# EasyEDA Pro project F103_遥控板_2025-11-19.epro

# Schematic F103遥控原理图
Board Name: 遥控板; Create Date: 2025-01-30; Page Name: P1; Project Name: F405空心杯飞控; Schematic Name: F103遥控原理图; Update Date: 2025-02-16; Company: 嘉立创EDA; Page Size: A4; Version: V1.0
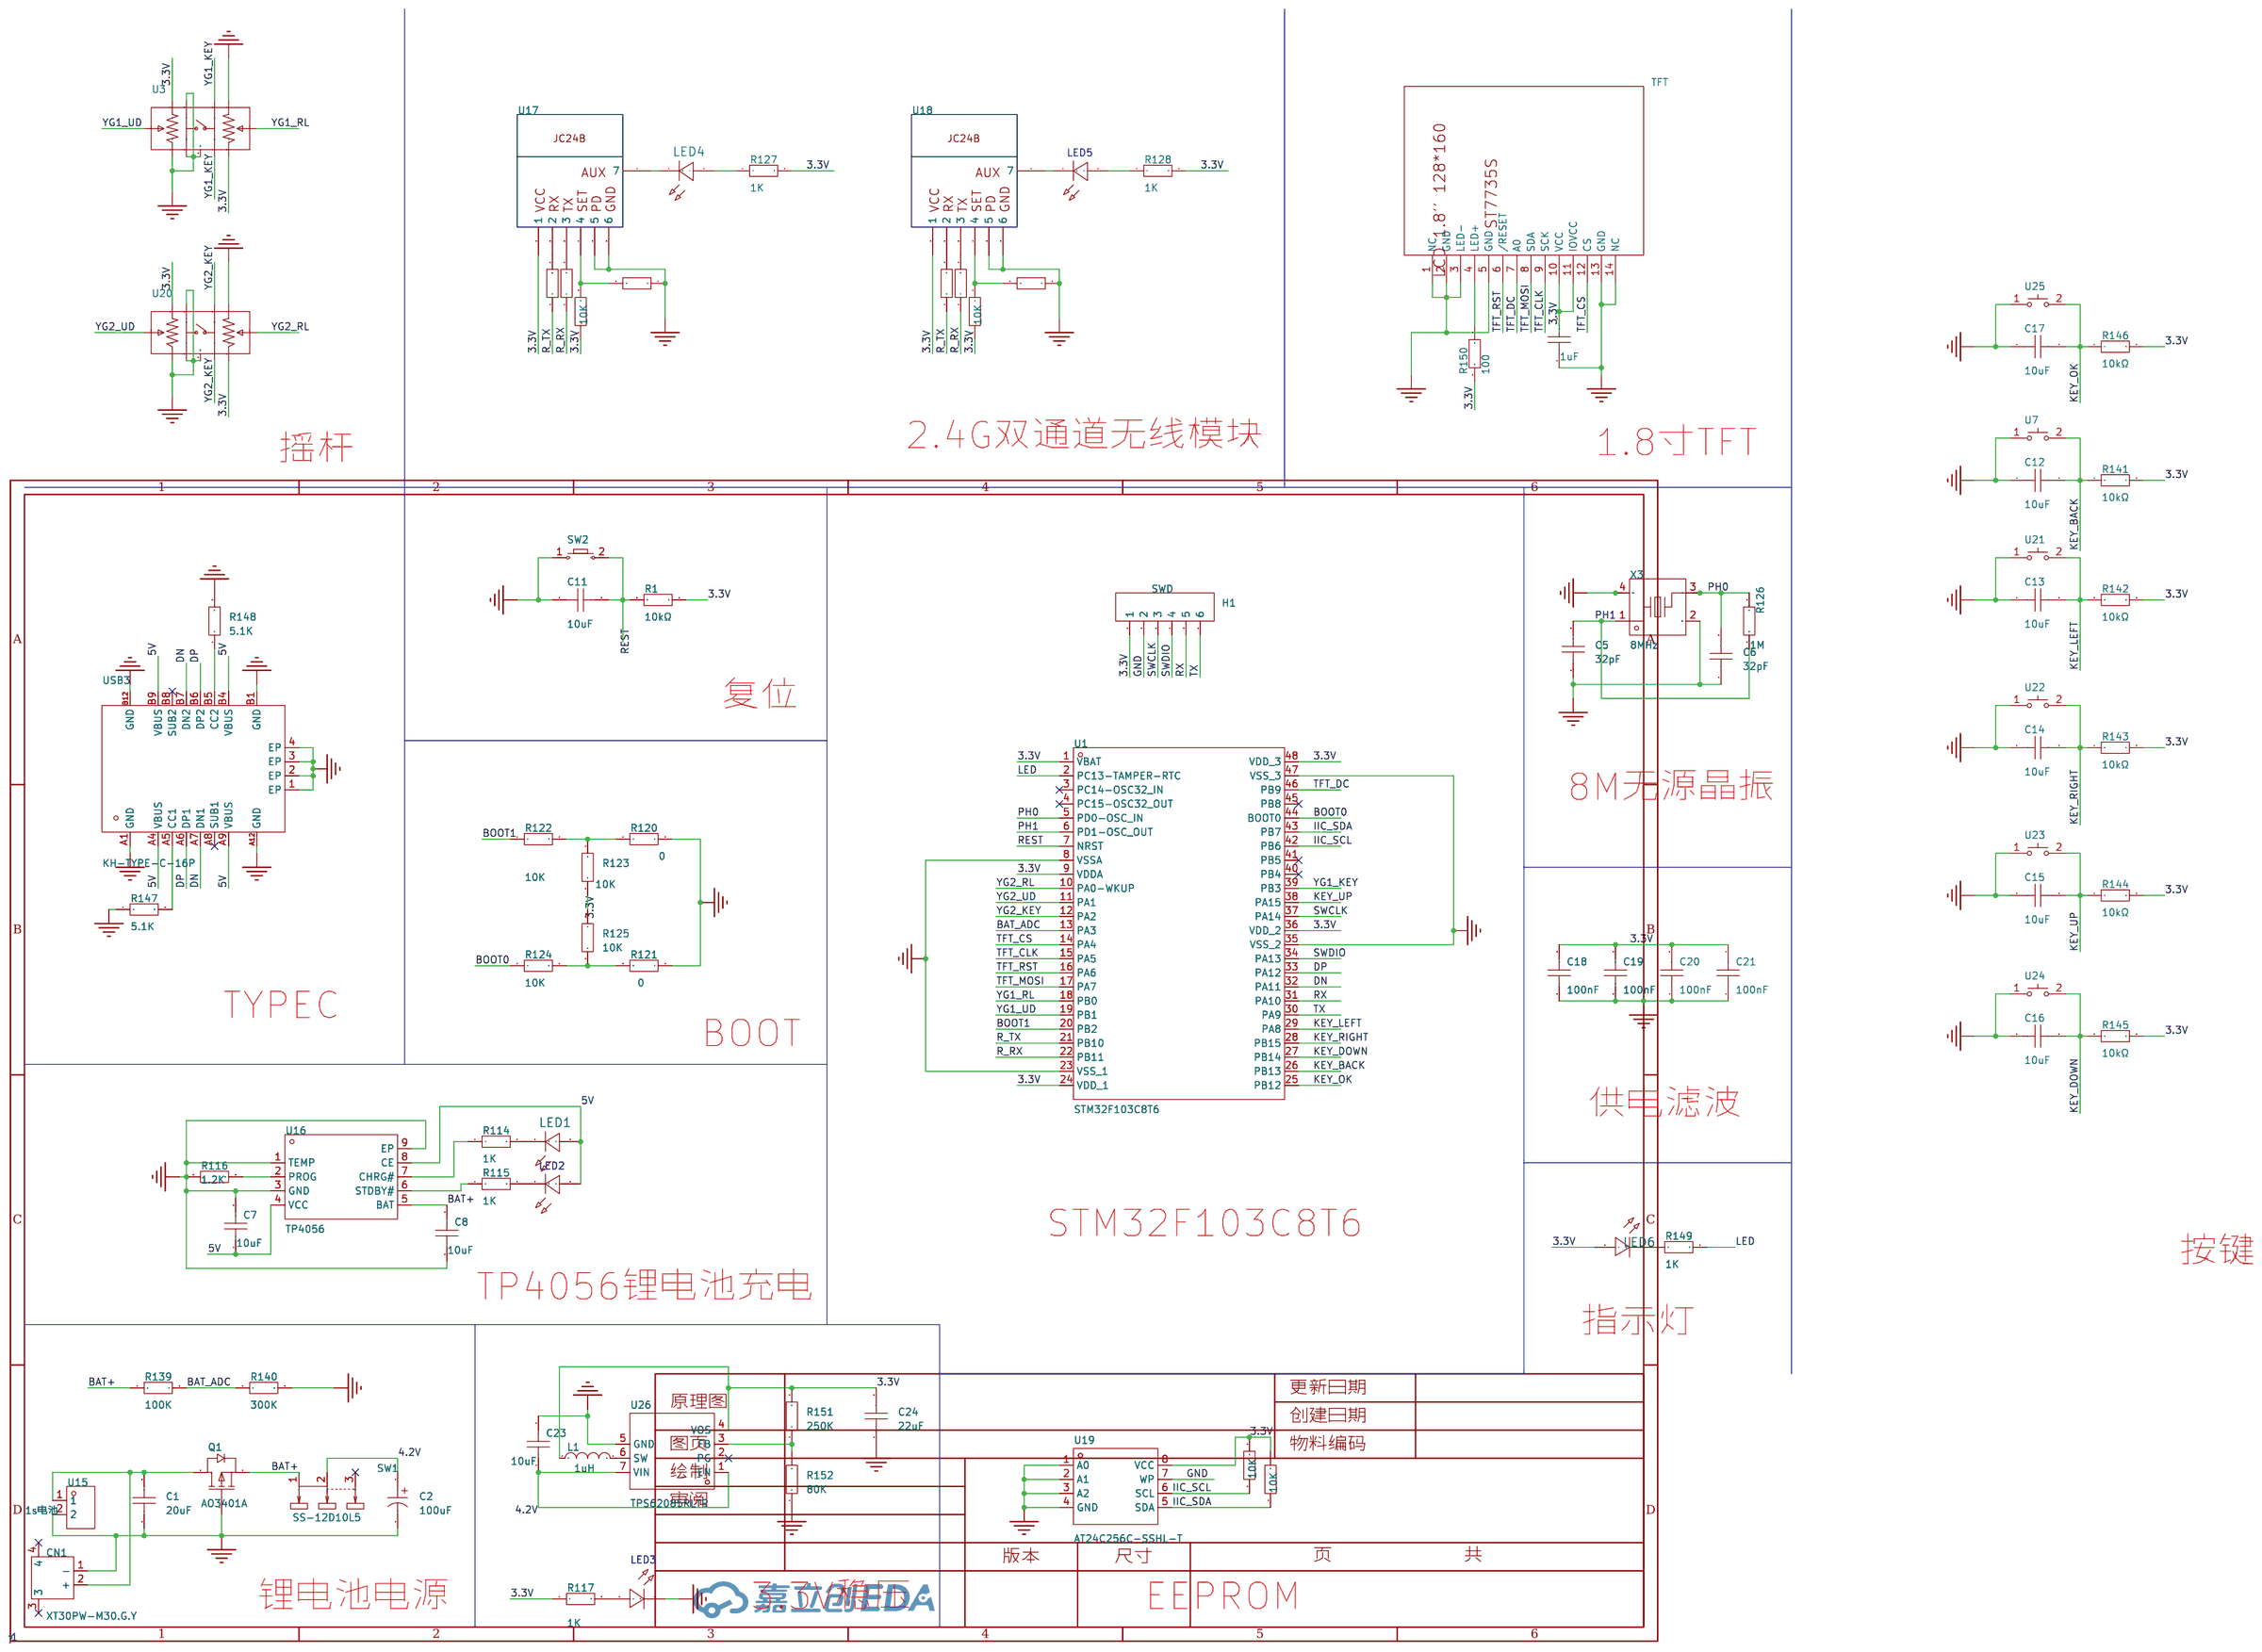
[diagram p0: schematic sheet]

## Parts
C1  20uF  [C0805]
C2  100uF  [CAP-SMD_BD6.3-L6.6-W6.6-LS7.4-FD]
C5  32pF  [C0603]
C6  32pF  [C0603]
C7  10uF  [C0805]
C8  10uF  [C0805]
C11  10uF  [C0805]
C12  10uF  [C0805]
C13  10uF  [C0805]
C14  10uF  [C0805]
C15  10uF  [C0805]
C16  10uF  [C0805]
C17  10uF  [C0805]
C18  100nF  [C0603]
C19  100nF  [C0603]
C20  100nF  [C0603]
C21  100nF  [C0603]
C22  1uF  [C0603]
C23  10uF  [C0805]
C24  22uF  [C0805]
CN1  XT30PW-M30.G.Y  [CONN-TH_XT30PW-M]
H1  SWD  [HDR-TH_6P-P2.54-V-M-1]
L1  1uH  [IND-SMD_L5.4-W5.2_FXL0530]
LCD2  TFT  [1.8寸TFT]
LED1  -  [LED_0805]
LED2  -  [LED_0805]
LED3  -  [LED_0805]
LED4  -  [LED_0805]
LED5  -  [LED_0805]
LED6  -  [LED_0805]
Q1  AO3401A  [SOT-23_L2.9-W1.3-P1.90-LS2.4-BR]
R1  10kΩ  [R0603]
R114  1K  [R0603]
R115  1K  [R0603]
R116  1.2K  [R0603]
R117  1K  [R0603]
R120  0  [R0402]
R121  0  [R0402]
R122  10K  [R0603]
R123  10K  [R0603]
R124  10K  [R0603]
R125  10K  [R0603]
R126  1M  [R0603]
R127  1K  [R0603]
R128  1K  [R0603]
R129  0  [R0402]
R130  0  [R0402]
R131  0  [R0402]
R132  10K  [R0603]
R133  0  [R0402]
R134  0  [R0402]
R135  0  [R0402]
R136  10K  [R0603]
R137  10K  [R0603]
R138  10K  [R0603]
R139  100K  [R0603]
R140  300K  [R0603]
R141  10kΩ  [R0603]
R142  10kΩ  [R0603]
R143  10kΩ  [R0603]
R144  10kΩ  [R0603]
R145  10kΩ  [R0603]
R146  10kΩ  [R0603]
R147  5.1K  [R0603]
R148  5.1K  [R0603]
R149  1K  [R0603]
R150  100  [R0603]
R151  250K  [R0603]
R152  80K  [R0603]
SW1  SS-12D10L5  [SW-TH_SS-12D10L5]
SW2  -  [Key_SMD_3x4x2]
U1  STM32F103C8T6  [LQFP-48_L7.0-W7.0-P0.50-LS9.0-BL]
U3  YHE-YG13-013 SH3B166A5  [JOYTICK-TH_YHE-YG13-013-SH3B166A5]
U7  TS-1199A26050  [SW-SMD_L6.0-W6.0-LS6.6]
U15  1s电池  [CONN-TH_2P-P2.50_BX-XH2.54-2PZZ]
U16  TP4056  [ESOP-8_L4.9-W3.9-P1.27-LS6.0-BL-EP]
U17  -  [JC24B]
U18  -  [JC24B]
U19  AT24C256C-SSHL-T  [SOIC-8_L4.9-W3.9-P1.27-LS6.0-BL]
U20  YHE-YG13-013 SH3B166A5  [JOYTICK-TH_YHE-YG13-013-SH3B166A5]
U21  TS-1199A26050  [SW-SMD_L6.0-W6.0-LS6.6]
U22  TS-1199A26050  [SW-SMD_L6.0-W6.0-LS6.6]
U23  TS-1199A26050  [SW-SMD_L6.0-W6.0-LS6.6]
U24  TS-1199A26050  [SW-SMD_L6.0-W6.0-LS6.6]
U25  TS-1199A26050  [SW-SMD_L6.0-W6.0-LS6.6]
U26  TPS62085RLTR  [VSON-7_L2.0-W2.0-P0.5-TL]
USB3  KH-TYPE-C-16P  [USB-C-SMD_KH-TYPE-C-16P]
X3  8MHz  [CRYSTAL-SMD_4P-L3.2-W2.5-BL]

## Library data of the parts
C1 C7 C8 C11-C17 C23 C24 = CAP_0805: Supplier Footprint: 0805
C2 = RVT100UF35V67RV0034: 容值:100uF;精度:±20%;额定电压:35V;纹波电流:87mA@120kHz;等效串联电阻:-;; LCSC Part Name: 100uF ±20% 35V; Supplier Part: C2836442; Manufacturer: KNSCHA(科尼盛); Supplier Footprint: SMD,D6.3xL7.7mm; JLCPCB Part Class: 扩展库; Datasheet: https://atta.szlcsc.com/upload/public/pdf/source/20210528/C2836442_7F6389BF36F63F32D6DF3A507E8E95D6.pdf; Supplier: LCSC; Tolerance: ±20%; Rated Voltage: 35V; Ripple Current: 87mA@120kHz; φD: 6.3mm; L: 7.7mm; Lifetime @ Temp: 2000hrs@105℃; Operating Temperature: -55℃~+105℃
C5 C6 C18-C22 = CAP_0603: Supplier Footprint: 0603
CN1 = XT30PW-M30.G.Y: 类别:-;类型1:-;; LCSC Part Name: AMASS(艾迈斯)航模插头 卧式弯脚 XT30PW-M公头; Supplier Part: C431092; Manufacturer: AMASS(艾迈斯); JLCPCB Part Class: 扩展库; Datasheet: https://atta.szlcsc.com/upload/public/pdf/source/20220222/6A9F22F7850E25B33E1BE430ADF8560B.pdf; Supplier: LCSC; Type: 航模插头; RatedVoltage: DC 500V; InterfaceType: 公头; RatedCurrent: 15A; RecommendedWireGauge: 16/18/20AWG; contact resistance: 1.2mΩ; specifications: 2pin
H1 = HDR-M_2.54_1x6P: Supplier Part: C37208; Supplier Footprint: 插件
L1 = FXL0530-1R0-M: 电感值:1uH;精度:±20%;额定电流:8.5A;饱和电流(Isat):11A;类型:一体成型电感;; LCSC Part Name: 1uH ±20% 11A; Supplier Part: C475517; Manufacturer: cjiang(长江微电); Supplier Footprint: SMD,5.2x5.4mm; JLCPCB Part Class: 扩展库; Datasheet: https://atta.szlcsc.com/upload/public/pdf/source/20240426/3189EA8206330E2108542F9E34E540E7.pdf; Supplier: LCSC; Tolerance: ±20%; Rated Current: 8.5A; Saturation Current (Isat): 11A; DC Resistance (DCR): 14mΩ; Type: 一体成型电感
LCD2 = 1.8寸TFT: 1.8寸，ST7735S
LED1 LED4 LED6 = LED_0805-R: Supplier Footprint: 0805
LED2 LED5 = LED_0805-B: Supplier Footprint: 0805
LED3 = LED_0805-G: Supplier Footprint: 0805
Q1 = AO3401A_C15127: 类型:1个P沟道;漏源电压(Vdss):30V;连续漏极电流(Id):4A;导通电阻(RDS(on)@Vgs,Id):44mΩ@10V,4.3A;功率(Pd):1.4W;阈值电压(Vgs(th)@Id):1.3V@250uA;; LCSC Part Name: 1个P沟道 耐压:30V 电流:4A; Supplier Part: C15127; Manufacturer: AOS; Supplier Footprint: SOT-23; JLCPCB Part Class: 基础库; Datasheet: https://atta.szlcsc.com/upload/public/pdf/source/20160507/1462613609053.pdf; Supplier: LCSC; Type: 1个P沟道; Drain Source Voltage (Vdss): 30V; Continuous Drain Current (Id): 4A; Drain Source On Resistance (RDS(on)@Vgs,Id): 44mΩ@10V,4.3A; Power Dissipation (Pd): 1.4W; Gate Threshold Voltage (Vgs(th)@Id): 1.3V@250uA; Total Gate Charge (Qg@Vgs): 12.2nC@4.5V; Input Capacitance (Ciss@Vds): 1.2nF@15V; Operating Temperature: -55℃~+150℃@(Tj)
R1 R141-R146 = 0805W8F4701T5E: 电阻类型:厚膜电阻;阻值:4.7kΩ;精度:±1%;功率:125mW;最大工作电压:150V;温度系数:±100ppm/℃;; LCSC Part Name: 4.7kΩ ±1% 125mW 厚膜电阻; Supplier Part: C17673; Manufacturer: UNI-ROYAL(厚声); Supplier Footprint: 0805; JLCPCB Part Class: 基础库; Datasheet: https://atta.szlcsc.com/upload/public/pdf/source/20200306/C422600_1E6D84923E4A46A82E41ADD87F860B5C.pdf; Supplier: LCSC; Type: 厚膜电阻; Tolerance: ±1%; Power(Watts): 125mW; Overload Voltage (Max): 150V; Temperature Coefficient: ±100ppm/℃; Operating Temperature Range: -55℃~+155℃
R114-R117 R122-R128 R132 R136-R140 R147-R152 = Res_0603: Supplier Footprint: 0603
R120 R121 R129-R131 R133-R135 = Res_0402: Supplier Footprint: 0402
SW1 = SS-12D10L5: 电路结构:单刀双掷;安装方式:直插;开关颜色:黑色;额定电流(DC):3A;额定电压(DC):125V;额定电流(AC):3A;额定电压(AC):125V;机械寿命:1万次;; LCSC Part Name: 柄长5mm 直插双档 滑动开关; Supplier Part: C319012; Manufacturer: XKB Connectivity(中国星坤); Supplier Footprint: 插件; JLCPCB Part Class: 扩展库; Datasheet: https://atta.szlcsc.com/upload/public/pdf/source/20211009/D6412F37AABE6F9459A6EE7FA4DAEADB.pdf; Supplier: LCSC; Circuit: 单刀双掷; Actuator Style: 矩形柱状; Pin Style: PC引脚; Switch Length: 13mm; Switch Width: 6.8mm; Switch Height: 6.4mm; Mounting Style: 直插; Actuator Color: 黑色; Current Rating (DC): 3A; Voltage Rating (DC): 125V; Current Rating (AC): 3A; Voltage Rating (AC): 125V; Mechanical Life: 1万次; Operating Temperature: -40℃~+85℃
SW2 = Key_SMD_3x4x2: Supplier Footprint: SMD
U1 = STM32F103C8T6: CPU内核:ARM-M3;CPU最大主频:72MHz;应用领域:-;; LCSC Part Name: 主流增强型ARM Cortex-M3 MCU，具有64 KB Flash、72 MHz CPU、电机控制、USB和CAN; Supplier Part: C8734; Manufacturer: ST(意法半导体); Supplier Footprint: LQFP-48(7x7); JLCPCB Part Class: 扩展库; Datasheet: https://atta.szlcsc.com/upload/public/pdf/source/20220812/8363ACEC51AD55ECEB84799464F7CB85.pdf; Supplier: LCSC; CPU Core: ARM-M3; CPU Maximum Speed: 72MHz; Program Storage Size: 64KB; Program Memory Type: FLASH; Number of I/O: 37; ADC (Bit): 12bit; Low Voltage Detection Threshold: 2V~3.6V
U3 U20 = YHE-YG13-013 SH3B166A5: 霍尔电位器摇杆、摇杆电位器、操纵杆电位器，适用于航模玩具遥控器电位器、3D摇杆PS4手柄游戏机、无人机摇杆电位器、VR摇杆电位器、工业控制器; Supplier Part: C42410941; Manufacturer: YTL(亚特联); Supplier Footprint: 插件; Datasheet: https://atta.szlcsc.com/upload/public/pdf/source/20241210/2E4471B96E441A4334C3B2A2D95CD7B2.pdf; Supplier: LCSC
U7 U21-U25 = TS-1199A26050: LCSC Part Name: 停产 6X6X5硅胶按键开关 260力度; Supplier Part: C7471808; Manufacturer: HanElectricity(瀚源); JLCPCB Part Class: 扩展库; Datasheet: https://atta.szlcsc.com/upload/public/pdf/source/20230804/DBC2CAE0DF05289A0977E10084746426.pdf; Supplier: LCSC
U15 = BX-XH2.54-2PZZ: 插针结构:1x2P;间距:2.54mm;安装方式:直插;参考系列:XH;总PIN数:2P;排数:1;每排PIN数:2;行距:-;额定电流:3A;触头材质:黄铜;触头镀层:锡;工作温度范围:-25℃~+85℃;; LCSC Part Name: 配套胶壳型号：BX-XH2.54-2PJK 配套端子型号：BX-XH2.54-DZ 配套杜邦线型号：BX-XH2.54-2PBXC; Supplier Part: C18077833; Manufacturer: Bossie(博锡); Supplier Footprint: 插件,P=2.54mm; JLCPCB Part Class: 扩展库; Datasheet: https://atta.szlcsc.com/upload/public/pdf/source/20231017/CB25E46A13930659CD6CDE2F2553A508.pdf; Supplier: LCSC; Pins Structure: 1x2P; Pitch: 2.54mm; Mounting Style: 直插; Reference Series: XH; Number of Pins: 2P; Number of Rows: 1; Number of PINs Per Row: 2; Current Rating (Max): 3A; Contact Material: 黄铜; Contact Plating: 锡; Operating Temperature Range: -25℃~+85℃
U16 = TP4056_C725790: Supplier Part: C725790; Manufacturer: UMW(友台半导体); Supplier Footprint: ESOP-8; JLCPCB Part Class: 扩展库; Datasheet: https://atta.szlcsc.com/upload/public/pdf/source/20231109/CF74897CE79A500F7FE27A45ADCCC631.pdf; Supplier: LCSC
U17 U18 = JC24B: J24B火蝠无线通信模块 距离200米  电压 / 3.3V  USART串口
U19 = AT24C256C-SSHL-T: 存储器容量:256Kb (32K x 8);存储器接口类型:I2C;工作电压:1.7V ~ 5.5V;; Supplier Part: C6482; Manufacturer: MICROCHIP(美国微芯); Supplier Footprint: SOIC-8_150mil; JLCPCB Part Class: Basic Part; Datasheet: https://atta.szlcsc.com/upload/public/pdf/source/20140724/1457707164965.pdf; Supplier: LCSC; Memory Format: EEPROM; Memory Size: 256Kb (32K x 8); Memory Interface: I2C; Voltage - Supply: 1.7V ~ 5.5V
U26 = TPS62085RLTR: 功能类型:降压型;输出类型:可调;工作电压:2.5V~6V;输出电压:-;输出电流:3A;; LCSC Part Name: 高效3A同步降压转换器; Supplier Part: C130072; Manufacturer: TI(德州仪器); Supplier Footprint: VSON-7(2x2); JLCPCB Part Class: 扩展库; Datasheet: https://www.ti.com/cn/lit/gpn/tps62085; Supplier: LCSC; Function: 降压型; Output Type: 可调; Input Voltage: 2.5V~6V; Output Current: 3A; Switching Frequency: 2.4MHz; Operating Temperature: -40℃~+125℃; Synchronous Rectification: 是; Number of Outputs: 1; Topology: 降压式; Quiescent Current (Iq): 17uA; Switch tube (built-in/external): 内置
USB3 = KH-TYPE-C-16P: 连接器类型:Type-C;标准:-;公母:母;端口数量:1;触点数量:16P;安装方式:卧贴;额定电流 - 电源:3A;工作温度范围:-40℃~+85℃;; LCSC Part Name: Type-C 母 卧贴; Supplier Part: C709357; Manufacturer: kinghelm(金航标); Supplier Footprint: SMD; JLCPCB Part Class: 扩展库; Datasheet: https://atta.szlcsc.com/upload/public/pdf/source/20200911/C709357_AA8DCEB38BB20E3035A7ED7AE7667837.pdf; Supplier: LCSC; Connector Type: Type-C; Gender: 母; Number of Ports: 1; Number of Contacts: 16P; Mounting Style: 卧贴; Current Rating - Power (Max): 3A; Operating Temperature Range: -40℃~+85℃
X3 = X32258MSB4SI: 晶振类型:贴片晶振;频率:8MHz;常温频差:±10ppm;外接负载电容:20pF;频率稳定度(全温):±20ppm;; LCSC Part Name: 8MHz ±10ppm 20pF; Supplier Part: C2682774; Manufacturer: YXC(扬兴晶振); Supplier Footprint: SMD3225-4P; JLCPCB Part Class: 扩展库; Datasheet: https://atta.szlcsc.com/upload/public/pdf/source/20240329/19D5F850207469550BEB00D7DFEDBC7A.pdf; Supplier: LCSC; Crystal Type: 贴片晶振; Normal temperature Frequency Tolerance: ±10ppm; External load capacitor: 20pF; Frequency Stability(Full temperature range): ±20ppm; Operating Temperature: -40℃~+85℃

## Nets
3.3V: C18.2 C19.2 C20.2 C21.2 C22.2 C24.2 H1.1 L1.1 LCD2.10(VCC) LCD2.11(IOVCC) LED6.2(A) R1.2 R117.1 R123.2 R125.2 R127.2 R128.2 R132.1 R136.1 R137.2 R138.2 R141.2 R142.2 R143.2 R144.2 R145.2 R146.2 R150.1 R151.2 U1.1(VBAT) U1.9(VDDA) U1.24(VDD_1) U1.36(VDD_2) U1.48(VDD_3) U3.3(R1) U3.6(R2) U17.1 U18.1 U19.8(VCC) U20.3(R1) U20.6(R2) U26.4(VOS)
4.2V: C2.1 C23.1 SW1.2 U26.1(EN) U26.7(VIN)
5V: C7.1 LED1.2(A) LED2.2(A) U16.4(VCC) U16.8(CE) USB3.A4(VBUS) USB3.A9(VBUS) USB3.B4(VBUS) USB3.B9(VBUS)
GND: C1.1 C2.2 C5.1 C6.1 C7.2 C8.1 C11.1 C12.1 C13.1 C14.1 C15.1 C16.1 C17.1 C18.1 C19.1 C20.1 C21.1 C22.1 C23.2 C24.1 CN1.1(-) H1.2 LCD2.1(NC) LCD2.2(GND) LCD2.3(LED-) LCD2.5(GND) LCD2.13(GND) LCD2.14(NC) LED3.1(C) Q1.1(G) R116.1 R120.2 R121.1 R131.1 R135.1 R140.2 R147.1 R148.2 R152.1 SW2.1 U1.8(VSSA) U1.23(VSS_1) U1.35(VSS_2) U1.47(VSS_3) U3.1(R1) U3.4(R2) U3.9(S3) U3.10(S4) U3.11(SHELL) U7.1 U15.2 U16.1(TEMP) U16.3(GND) U16.9(EP) U17.5 U17.6 U18.5 U18.6 U19.1(A0) U19.2(A1) U19.3(A2) U19.4(GND) U19.7(WP) U20.1(R1) U20.4(R2) U20.9(S3) U20.10(S4) U20.11(SHELL) U21.1 U22.1 U23.1 U24.1 U25.1 U26.5(GND) USB3.1(EP) USB3.2(EP) USB3.3(EP) USB3.4(EP) USB3.A1(GND) USB3.A12(GND) USB3.B1(GND) USB3.B12(GND) X3.2(GND) X3.4(GND)
BAT+: C8.2 Q1.2(S) R139.1 SW1.1 U16.5(BAT)
BAT_ADC: R139.2 R140.1 U1.13(PA3)
BOOT0: R124.1 U1.44(BOOT0)
BOOT1: R122.1 U1.20(PB2)
DN: U1.32(PA11) USB3.A7(DN1) USB3.B7(DN2)
DP: U1.33(PA12) USB3.A6(DP1) USB3.B6(DP2)
IIC_SCL: R137.1 U1.42(PB6) U19.6(SCL)
IIC_SDA: R138.1 U1.43(PB7) U19.5(SDA)
KEY_BACK: C12.2 R141.1 U1.26(PB13) U7.2
KEY_DOWN: C16.2 R145.1 U1.27(PB14) U24.2
KEY_LEFT: C13.2 R142.1 U1.29(PA8) U21.2
KEY_OK: C17.2 R146.1 U1.25(PB12) U25.2
KEY_RIGHT: C14.2 R143.1 U1.28(PB15) U22.2
KEY_UP: C15.2 R144.1 U1.38(PA15) U23.2
LED: R149.2 U1.2(PC13-TAMPER-RTC)
PH0: C6.2 R126.1 U1.5(PD0-OSC_IN) X3.3
PH1: C5.2 R126.2 U1.6(PD1-OSC_OUT) X3.1
R_RX: R130.1 R134.1 U1.22(PB11)
R_TX: R129.1 R133.1 U1.21(PB10)
REST: C11.2 R1.1 SW2.2 U1.7(NRST)
RX: H1.5 U1.31(PA10)
SWCLK: H1.3 U1.37(PA14)
SWDIO: H1.4 U1.34(PA13)
TFT_CLK: LCD2.9(SCK) U1.15(PA5)
TFT_CS: LCD2.12(CS) U1.14(PA4)
TFT_DC: LCD2.7(A0) U1.46(PB9)
TFT_MOSI: LCD2.8(SDA) U1.17(PA7)
TFT_RST: LCD2.6(/RESET) U1.16(PA6)
TX: H1.6 U1.30(PA9)
YG1_KEY: U1.39(PB3) U3.7(S1) U3.8(S2)
YG1_RL: U1.18(PB0) U3.5(R2)
YG1_UD: U1.19(PB1) U3.2(R1)
YG2_KEY: U1.12(PA2) U20.7(S1) U20.8(S2)
YG2_RL: U1.10(PA0-WKUP) U20.5(R2)
YG2_UD: U1.11(PA1) U20.2(R1)
$1N13811: L1.2 U26.6(SW)
$1N13827: R151.1 R152.2 U26.3(FB)
Net-(C1-2): C1.2 CN1.2(+) Q1.3(D) U15.1
Net-(LCD2-4): LCD2.4(LED+) R150.2
Net-(LED1-1): LED1.1(C) R114.2
Net-(LED2-1): LED2.1(C) R115.2
Net-(LED3-2): LED3.2(A) R117.2
Net-(LED4-1): LED4.1(C) U17.7
Net-(LED4-2): LED4.2(A) R127.1
Net-(LED5-1): LED5.1(C) U18.7
Net-(LED5-2): LED5.2(A) R128.1
Net-(LED6-1): LED6.1(C) R149.1
Net-(R114-1): R114.1 U16.7(CHRG#)
Net-(R115-1): R115.1 U16.6(STDBY#)
Net-(R116-2): R116.2 U16.2(PROG)
Net-(R120-1): R120.1 R122.2 R123.1
Net-(R121-2): R121.2 R124.2 R125.1
Net-(R129-2): R129.2 U17.2
Net-(R130-2): R130.2 U17.3
Net-(R131-2): R131.2 R132.2 U17.4
Net-(R133-2): R133.2 U18.2
Net-(R134-2): R134.2 U18.3
Net-(R135-2): R135.2 R136.2 U18.4
Net-(R147-2): R147.2 USB3.A5(CC1)
Net-(R148-1): R148.1 USB3.B5(CC2)

Not connected (* = marked no-connect by the designer): CN1 3* 4*; SW1 3*; U1 3(PC14-OSC32_IN)* 4(PC15-OSC32_OUT)* 40(PB4)* 41(PB5)* 45(PB8)*; U26 2(PG)*; USB3 A8(SUB1)* B8(SUB2)*

## Notes on the sheet
- 2.4G双通道无线模块
- 1.8寸TFT
- 摇杆
- 复位
- 8M无源晶振
- TYPEC
- BOOT
- 供电滤波
- STM32F103C8T6
- 按键
- TP4056锂电池充电
- 指示灯
- 锂电池电源
- 3.3V稳压
- EEPROM

# Board PCB2
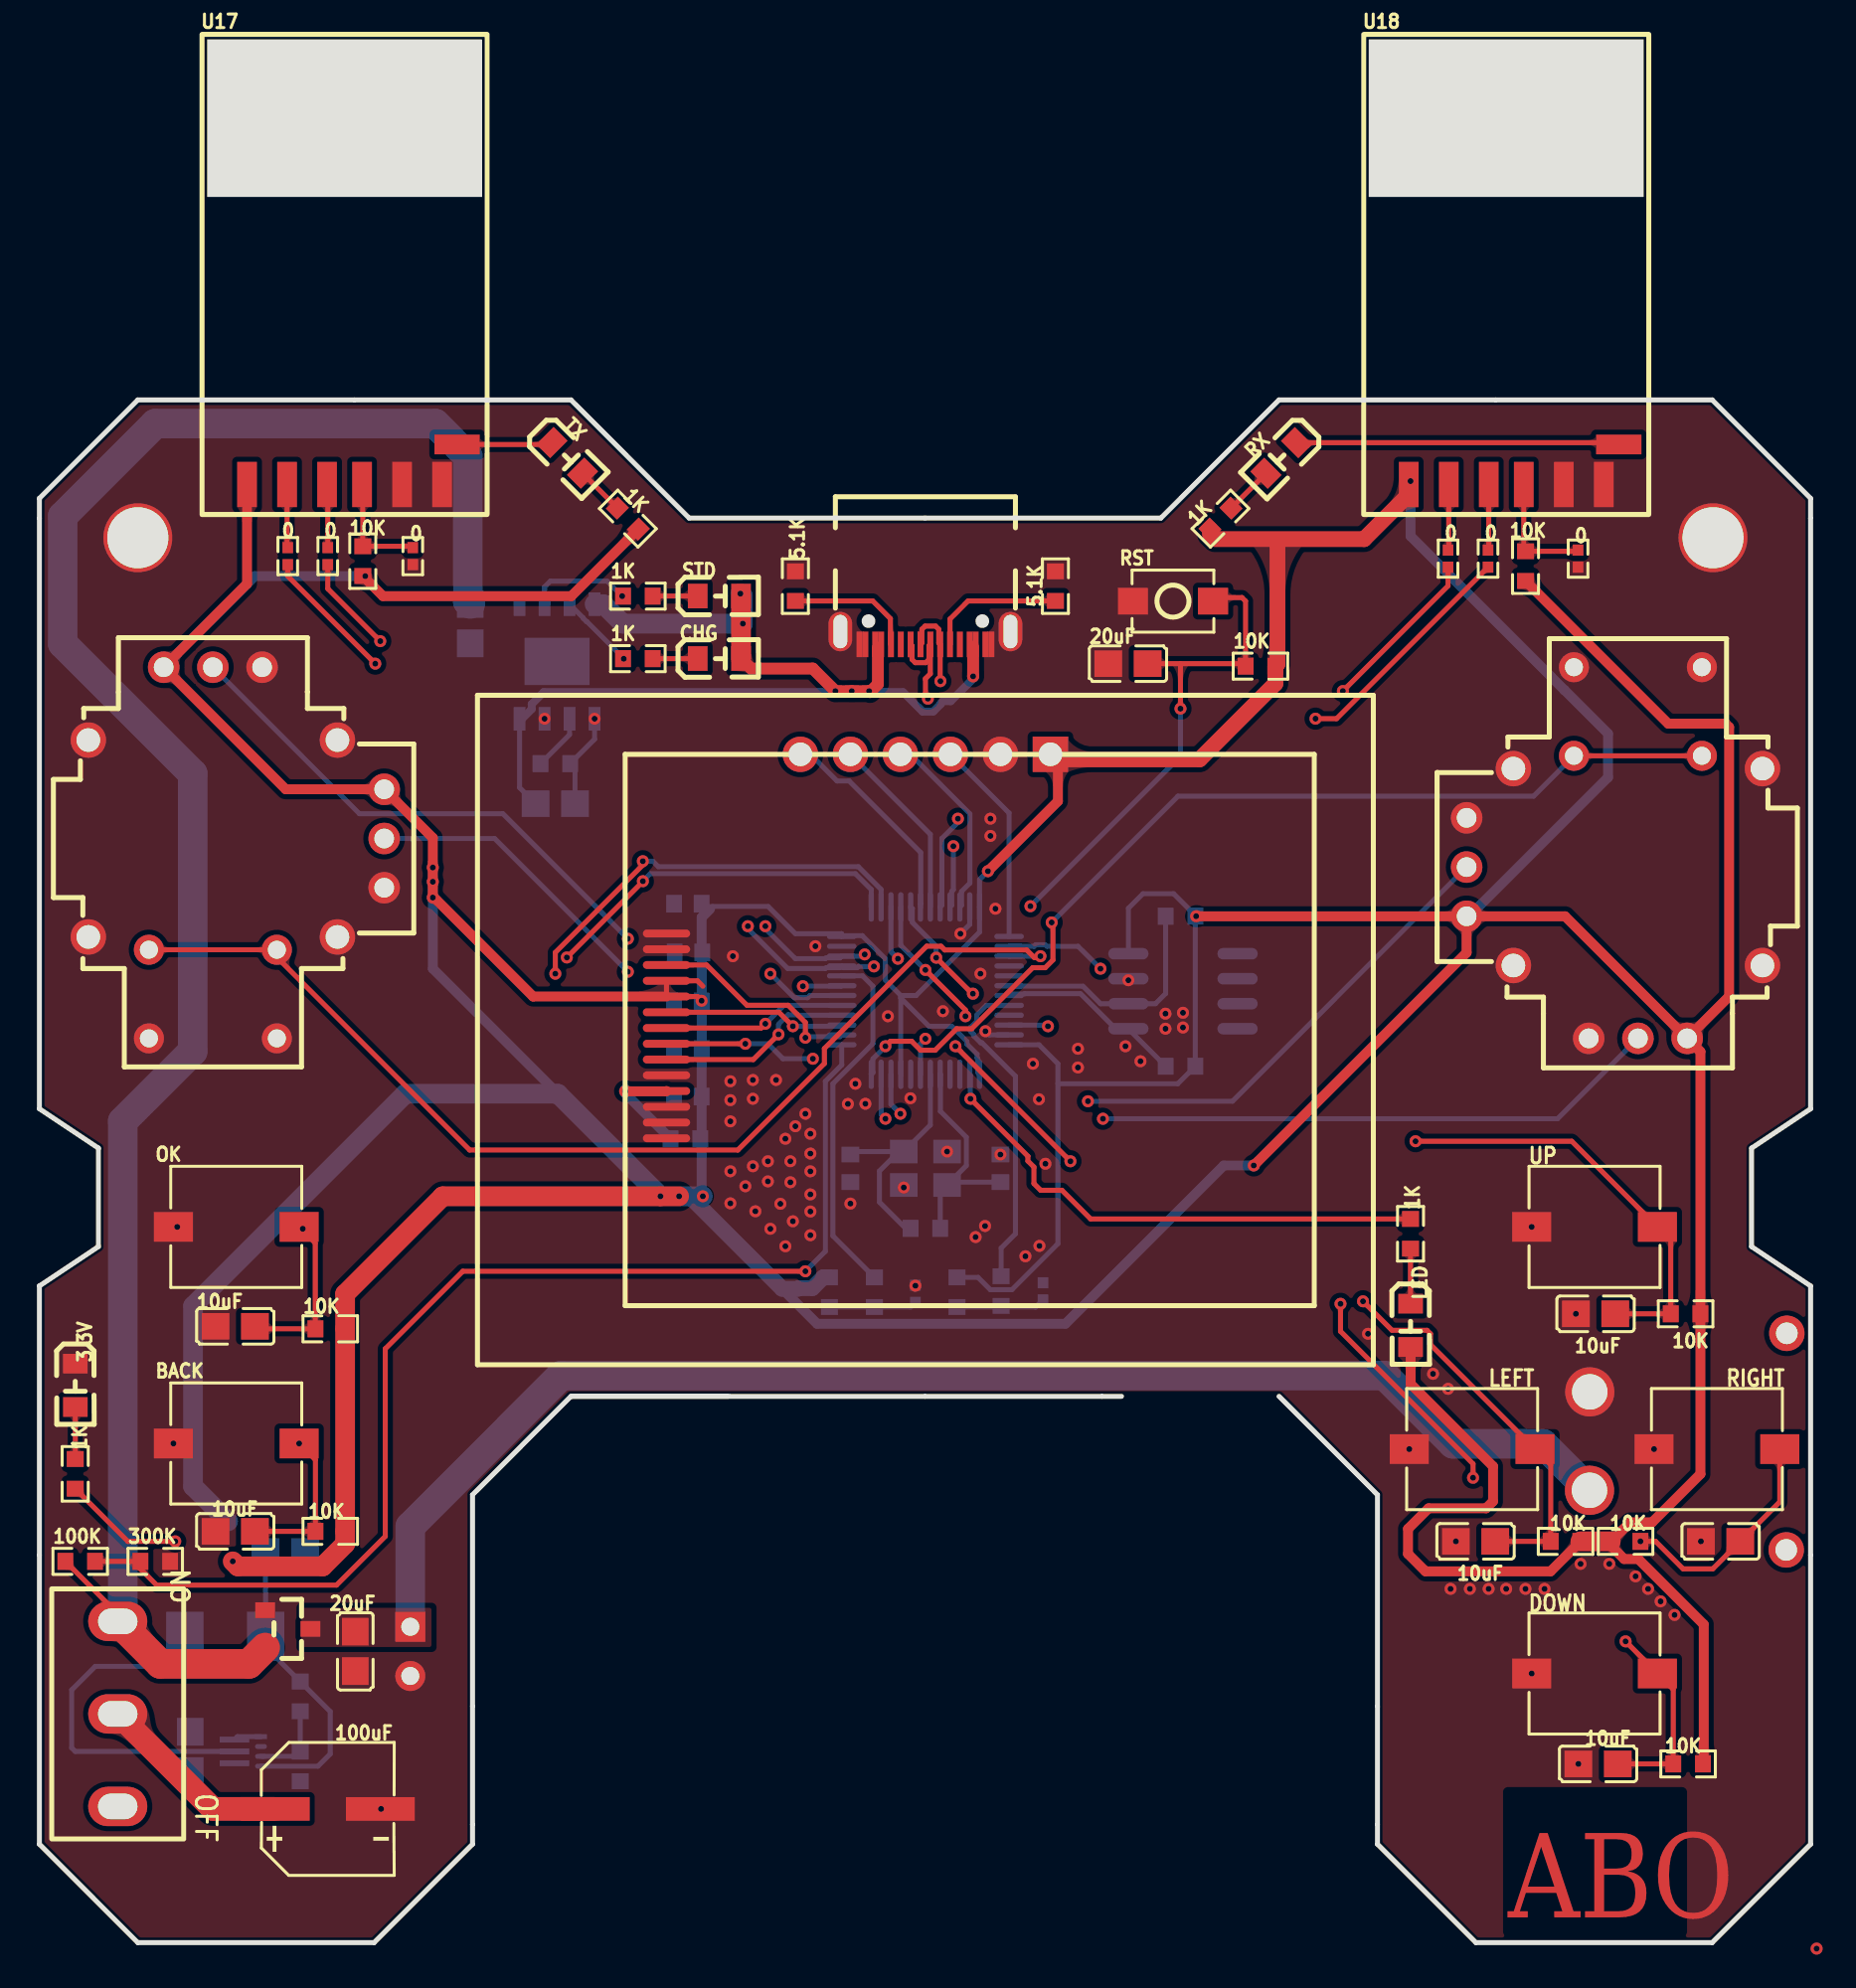
[diagram p1: board, top side]
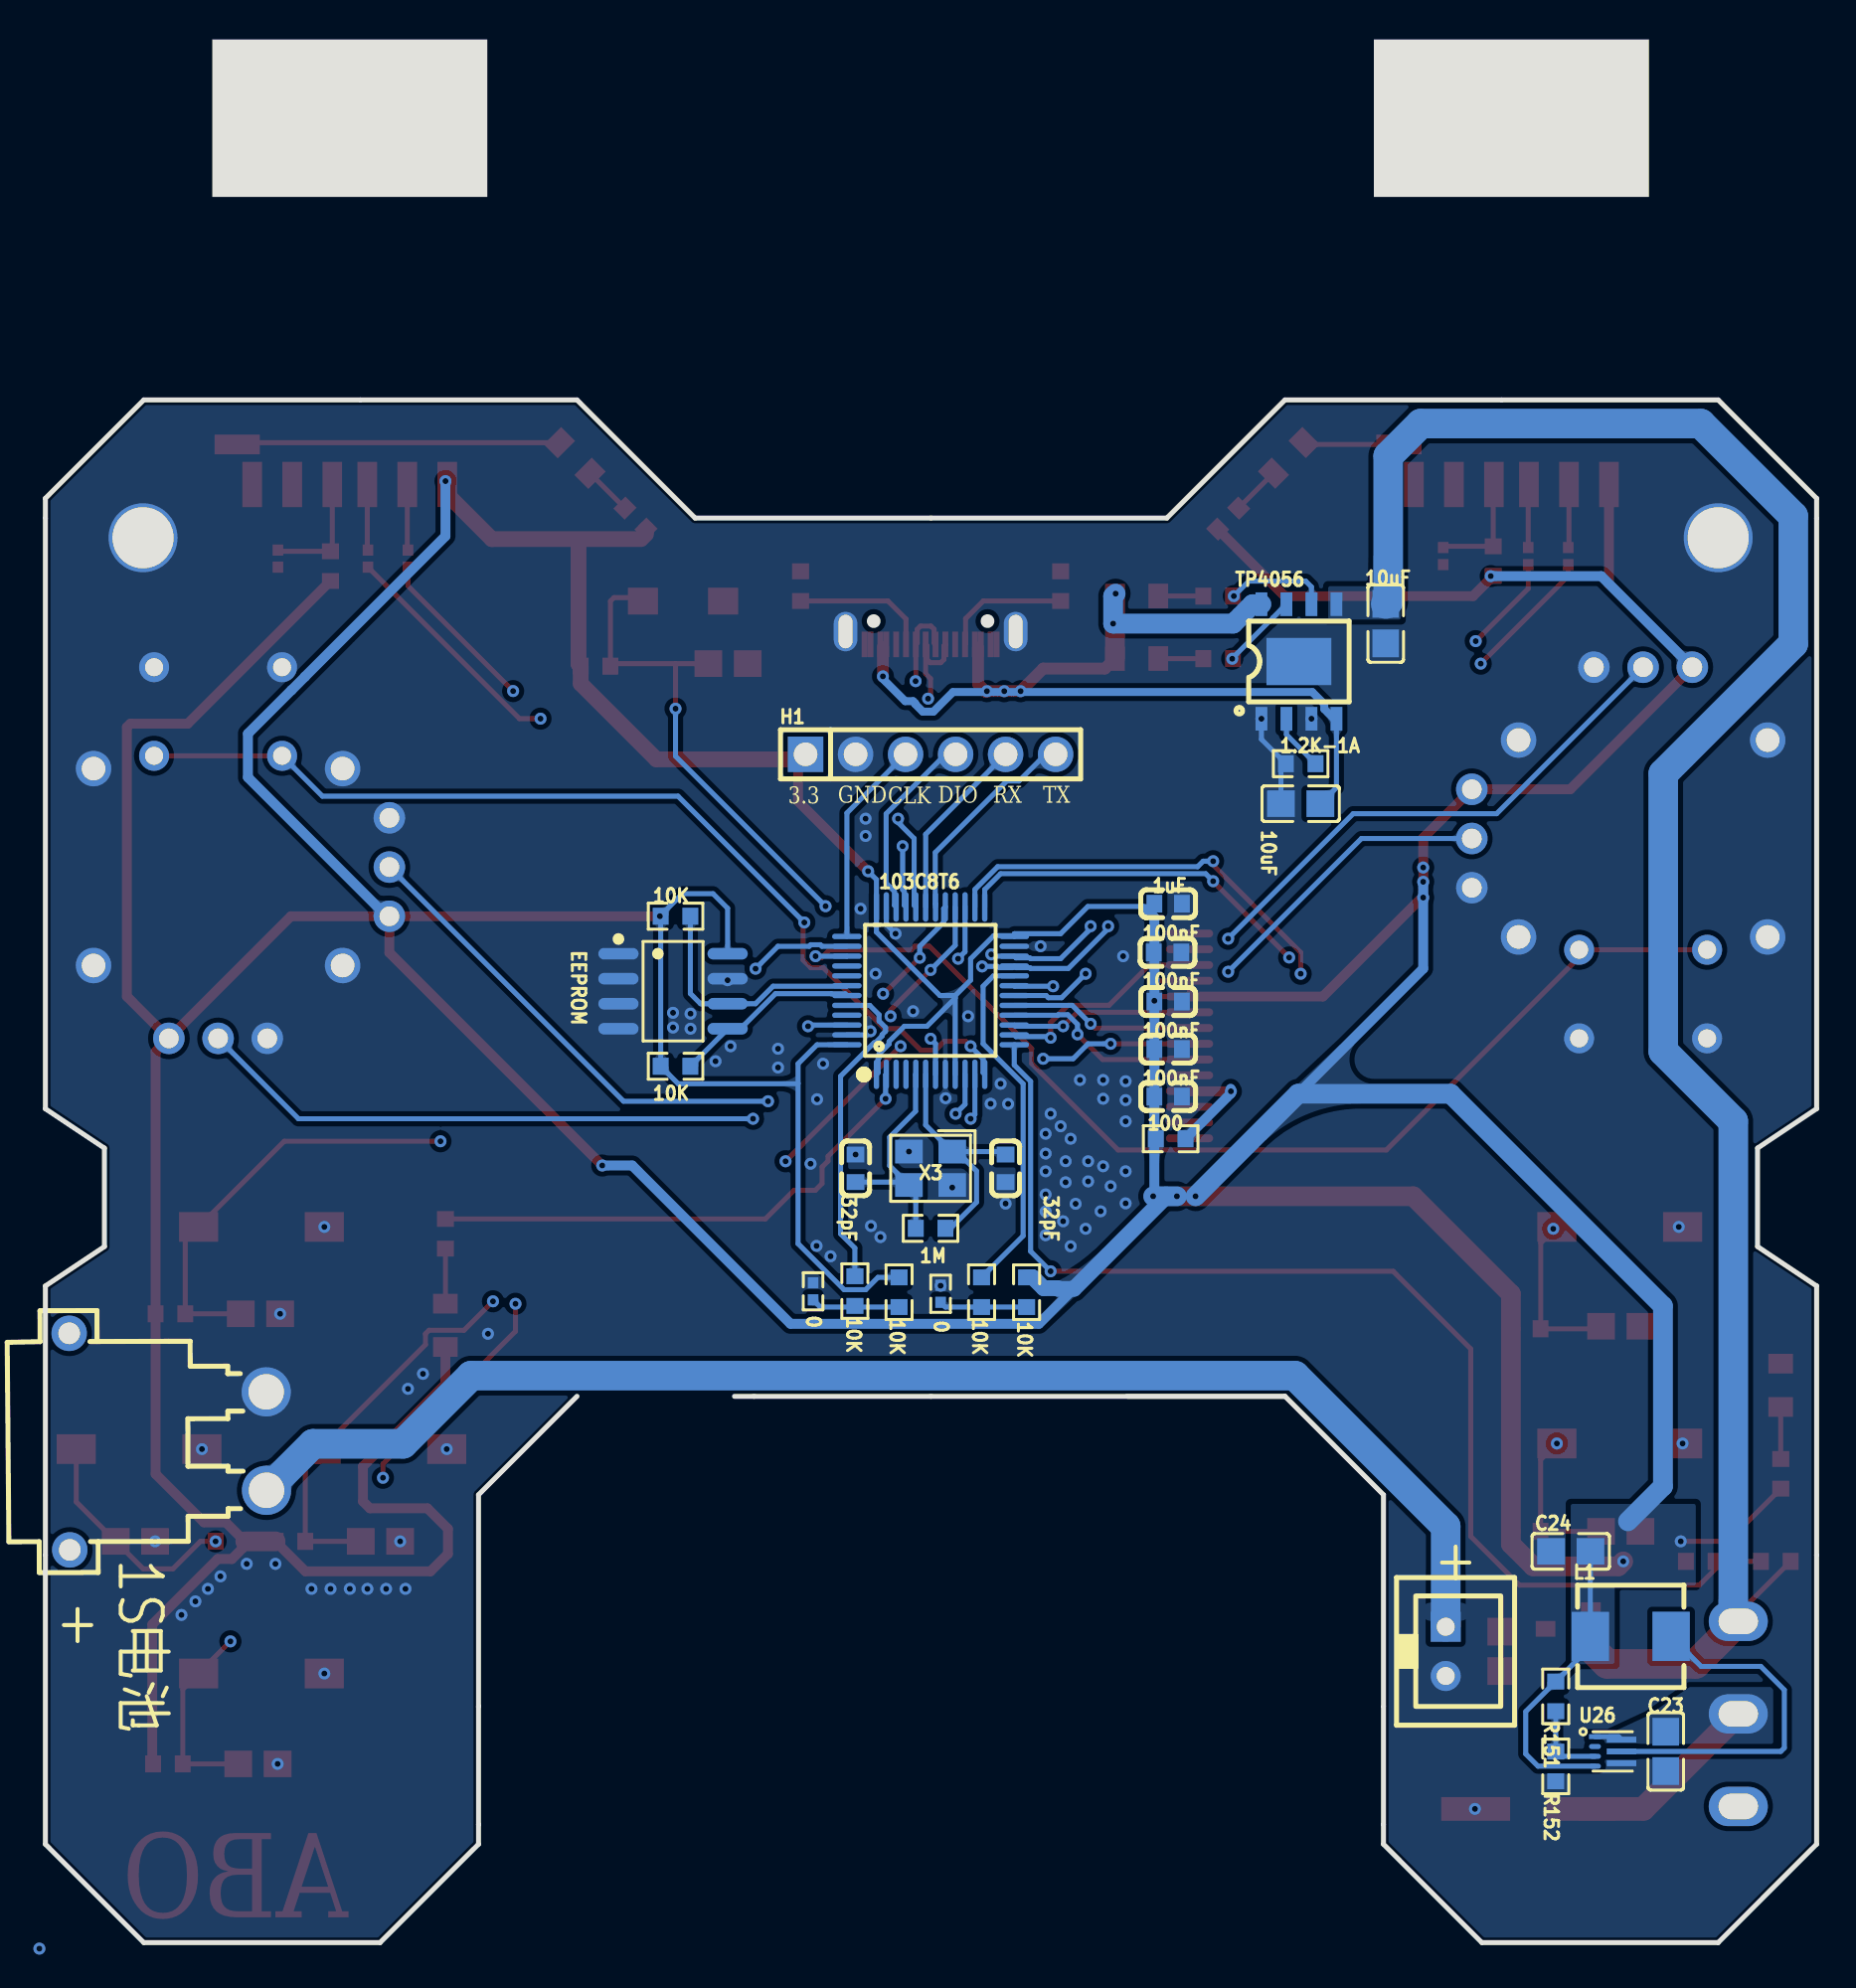
[diagram p2: board, bottom side, seen from below]

Outline 89.96 x 96.66 mm; copper layers: Top Layer, Inner1, Inner2, Bottom Layer. Coordinates in mm from the lower left corner of the outline.
Outline path: 27,27.74 22,22.75 22,5 17,0 5,0 0,5 0,33.35 3,35.35 3,40.35 0,42.35 0,73.35 5,78.35 27,78.35 33,72.35 56.96,72.35 62.96,78.35 84.96,78.35 89.96,73.35 89.96,42.35 86.96,40.35 86.96,35.35 89.96,33.35 89.96,5 84.96,0 72.96,0 67.96,5 67.96,22.75 62.96,27.74 ; 27,27.74 35,27.74 ; 27,27.74 54.96,27.74
Stack: Top Layer 0.035mm 外层铜厚1oz / Dielectric1 0.2104mm 7628 RC49% 8.6mil / Inner1 0.0152mm 内层铜厚 / Dielectric2 1.065mm 1.1mm H/HOZ Copper / Inner2 0.0152mm 内层铜厚 / Dielectric3 0.2104mm 7628 RC49% 8.6mil / Bottom Layer 0.035mm 外层铜厚1oz

## Design rules (mm)
template: 自定义配置
spacing copperThickness1oz (default): track to track 0.102, other pairs 0.152 to 0.3
spacing copperThickness2oz: track to track 0.203, other pairs 0.152 to 0.3
track width copperThickness1oz (default): min 0.127, default 0.254, max 2.54
track width copperThickness2oz: min 0.203, default 0.254, max 2.54
differential pair differentialPair (default): width min 0.127, default 0.254, max 2.54; gap min 0.152, default 0.152
via viaSize (default): diameter min 0.5, default 0.61, max 10; hole min 0.3, default 0.305, max 6.3
net GND uses copperRegion1
net 4.2V uses copperRegion1
net 3.3V uses copperRegion1
net BAT+ uses copperRegion1
net $1N9396 uses copperRegion1

## Placement (name value [footprint] x y rotation side)
0  -  [R0402]  12.61 70.42 90 top
0#2  -  [R0402]  14.65 70.42 90 top
0#3  -  [R0402]  18.97 70.42 90 top
0#4  -  [R0402]  71.54 70.29 90 top
0#5  -  [R0402]  73.57 70.29 90 top
0#6  -  [R0402]  78.15 70.29 90 top
0#7  -  [R0402]  44.49 32.95 90 bottom
0#8  -  [R0402]  50.97 33.08 270 bottom
1.2K-1A  1.2K  [R0603]  26.2 59.88 180 bottom
1K  -  [R0603]  69.64 36 90 top
1K#2  -  [R0603]  30.4 65.21 0 top
1K#3  -  [R0603]  30.4 68.38 0 top
1K#4  -  [R0603]  1.82 23.81 90 top
1K#5  -  [R0603]  29.89 72.32 315 top
1K#6  -  [R0603]  59.99 72.32 225 top
1M  1M  [R0603]  45 36.28 180 bottom
1uF  1uF  [C0603]  32.94 52.76 0 bottom
3.3V  -  [LED_0805]  1.82 28.25 270 top
5.1K  -  [R0603]  51.6 68.89 270 top
5.1K#2  -  [R0603]  38.4 68.89 90 top
10K  -  [R0603]  62.02 64.83 0 top
10K#2  -  [R0603]  16.42 70.16 90 top
10K#3  -  [R0603]  75.48 69.91 90 top
10K#4  -  [R0603]  14.77 20.89 0 top
10K#5  -  [R0603]  77.51 20.38 0 top
10K#6  -  [R0603]  80.56 20.38 180 top
10K#7  -  [R0603]  83.61 31.94 0 top
10K#8  -  [R0603]  83.74 9.08 0 top
10K#9  -  [R0603]  14.77 31.17 0 top
10K#10  -  [R0603]  42.41 33.03 270 bottom
10K#11  -  [R0603]  40.12 33.03 90 bottom
10K#12  -  [R0603]  48.85 33.09 270 bottom
10K#13  -  [R0603]  46.6 33.03 90 bottom
10K#14  -  [R0603]  57.95 52.13 0 bottom
10K#15  -  [R0603]  57.95 44.51 0 bottom
10uF  -  [C0805]  9.95 20.89 0 top
10uF#2  -  [C0805]  72.94 20.38 0 top
10uF#3  -  [C0805]  79.04 31.94 0 top
10uF#4  -  [C0805]  79.16 9.08 0 top
10uF#5  -  [C0805]  9.95 31.3 0 top
10uF#6  -  [C0805]  26.2 57.84 0 bottom
10uF#7  -  [C0805]  21.89 66.99 90 bottom
20uF  -  [C0805]  16.04 14.79 90 top
20uF#2  -  [C0805]  55.29 64.96 0 top
32pF  -  [C0603]  41.19 39.33 90 bottom
32pF#2  -  [C0603]  48.81 39.33 270 bottom
100  100  [R0603]  32.81 40.83 180 bottom
100K  100K  [R0603]  2.07 19.36 0 top
100nF  -  [C0603]  32.94 42.97 0 bottom
100nF#2  -  [C0603]  32.94 45.38 0 bottom
100nF#3  -  [C0603]  32.97 50.29 0 bottom
100nF#4  -  [C0603]  32.94 47.8 0 bottom
100uF  100uF  [CAP-SMD_BD6.3-L6.6-W6.6-LS7.4-FD]  14.65 6.79 0 top
103C8T6  STM32F103C8T6  [LQFP-48_L7.0-W7.0-P0.50-LS9.0-BL]  45 48.35 180 bottom
300K  300K  [R0603]  5.88 19.36 0 top
BACK  TS-1199A26050  [SW-SMD_L6.0-W6.0-LS6.6]  10 25.35 0 top
C14  10uF  [C0805]  85.39 20.38 0 top
C23  10uF  [C0805]  7.66 9.71 270 bottom
C24  22uF  [C0805]  12.49 19.87 180 bottom
CHG  -  [LED_0805]  34.59 65.21 0 top
CN1  XT30PW-M30.G.Y  [CONN-TH_XT30PW-M]  83.74 25.46 269.8 bottom
EEPROM  AT24C256C-SSHL-T  [SOIC-8_L4.9-W3.9-P1.27-LS6.0-BL]  58.08 48.32 270 bottom
H1  SWD  [HDR-TH_6P-P2.54-V-M-1]  45 60.35 180 bottom
L1  1uH  [IND-SMD_L5.4-W5.2_FXL0530]  9.44 15.55 180 bottom
LCD2  TFT  [1.8寸TFT]  22.25 29.35 0 top
LED  -  [LED_0805]  69.64 31.3 270 top
NOREF  -  [Pad_e6953]  85 71.35 0 top
NOREF#2  -  [Pad_e6955]  5 71.35 0 top
OK  TS-1199A26050  [SW-SMD_L6.0-W6.0-LS6.6]  10 36.35 0 top
ON  SS-12D10L5  [SW-TH_SS-12D10L5]  3.98 11.62 270 top
Q1  AO3401A  [SOT-23_L2.9-W1.3-P1.90-LS2.4-BR]  12.61 15.93 180 top
R151  250K  [R0603]  13.25 12.5 90 bottom
R152  80K  [R0603]  13.25 8.95 90 bottom
RST  -  [Key_SMD_3x4x2]  57.57 68.13 0 top
RX  -  [LED_0805]  63.03 75.37 225 top
STD  -  [LED_0805]  34.59 68.38 0 top
TP4056  TP4056  [ESOP-8_L4.9-W3.9-P1.27-LS6.0-BL-EP]  26.29 65.07 180 bottom
TX  -  [LED_0805]  26.84 75.37 315 top
U3  YHE-YG13-013 SH3B166A5  [JOYTICK-TH_YHE-YG13-013-SH3B166A5]  10 55.35 90 top
U15  1s电池  [CONN-TH_2P-P2.50_BX-XH2.54-2PZZ]  18.84 14.79 270 bottom
U17  -  [JC24B]  15.5 84.85 0 top
U18  -  [JC24B]  74.5 84.85 0 top
U20  YHE-YG13-013 SH3B166A5  [JOYTICK-TH_YHE-YG13-013-SH3B166A5]  80 55.35 270 top
U21  TS-1199A26050  [SW-SMD_L6.0-W6.0-LS6.6]  72.77 25.06 0 top
U22  TS-1199A26050  [SW-SMD_L6.0-W6.0-LS6.6]  85.2 25.06 0 top
U23  TS-1199A26050  [SW-SMD_L6.0-W6.0-LS6.6]  78.98 36.35 0 top
U24  TS-1199A26050  [SW-SMD_L6.0-W6.0-LS6.6]  78.98 13.67 0 top
U26  TPS62085RLTR  [VSON-7_L2.0-W2.0-P0.5-TL]  10.58 9.71 180 bottom
USB3  KH-TYPE-C-16P  [USB-C-SMD_KH-TYPE-C-16P]  45 68.35 180 top
X3  8MHz  [CRYSTAL-SMD_4P-L3.2-W2.5-BL]  45 39.33 0 bottom

## Footprints (pads in the part's own frame, mm; a bottom-side part is the same pattern mirrored in y, then rotated)
1.8寸TFT
  oval 2.4x0.4 smd: 1(9.6,11.5) 2(9.6,12.3) 3(9.6,13.1) 4(9.6,13.9) 5(9.6,14.7) 6(9.6,15.5) 7(9.6,16.3) 8(9.6,17.1) 9(9.6,17.9) 10(9.6,18.7) 11(9.6,19.5) 12(9.6,20.3) 13(9.6,21.1) 14(9.6,21.9)
C0603
  rect 0.8x0.9 smd: 1(-0.7,0) 2(0.7,0)
C0805
  rect 1.41x1.35 smd: 1(-1,0) 2(1,0)
CAP-SMD_BD6.3-L6.6-W6.6-LS7.4-FD
  rect 3.5x1.2 smd: 1(-2.67,0) 2(2.67,0)
CONN-TH_2P-P2.50_BX-XH2.54-2PZZ
  rect 1.524x1.524 hole 0.914: 1(-1.25,0)
  round 1.524 hole 0.914: 2(1.25,0)
CONN-TH_XT30PW-M
  round 2.5 hole 1.8: 1(-2.5,5) 2(2.5,5)
  round 1.8 hole 1.1: 3(5.5,-5) 4(-5.5,-5)
CRYSTAL-SMD_4P-L3.2-W2.5-BL
  rect 1.4x1.2 smd: 1(-1.1,-0.85) 2(1.1,-0.85) 3(1.1,0.85) 4(-1.1,0.85)
ESOP-8_L4.9-W3.9-P1.27-LS6.0-BL-EP
  rect 0.6x1.2 smd: 1(-1.905,-2.909) 2(-0.635,-2.909) 3(0.635,-2.909) 4(1.905,-2.909) 5(1.905,2.909) 6(0.635,2.909) 7(-0.635,2.909) 8(-1.905,2.909)
  rect 3.3x2.4 smd: 9(0,0)
HDR-TH_6P-P2.54-V-M-1
  rect 1.8x1.8 hole 1.2: 1(-6.35,0)
  round 1.8 hole 1.2: 2(-3.81,0) 3(-1.27,0) 4(1.27,0) 5(3.81,0) 6(6.35,0)
IND-SMD_L5.4-W5.2_FXL0530
  rect 1.9x2.5 smd: 1(-2.05,0) 2(2.05,0)
JC24B
  rect 1x2.3 smd: 1(-4.953,-10.795) 2(-2.921,-10.795) 3(-0.889,-10.795) 4(0.889,-10.795) 5(2.921,-10.795) 6(4.953,-10.795)
  rect 2.3x1 smd: 7(5.715,-8.763)
JOYTICK-TH_YHE-YG13-013-SH3B166A5
  round 1.6 hole 1: 1(-1.775,-7.513) 2(0.725,-7.513) 3(3.225,-7.513) 4(9.425,-1.312) 5(9.425,1.188) 6(9.425,3.688)
  round 1.524 hole 0.914: 7(-4.925,4.438) 8(-4.925,-2.062) 9(-9.425,4.438) 10(-9.425,-2.062)
  round 1.8 hole 1.2: 11(-4.275,7.513) 11(-4.275,-5.138) 11(5.725,7.513) 11(5.725,-5.138)
Key_SMD_3x4x2
  rect 1.53x1.36 smd: 1(-2.035,0) 2(2.035,0)
LED_0805
  rect 1x1.25 smd: 1(-1.15,0.005) 2(1.05,0.005)
LQFP-48_L7.0-W7.0-P0.50-LS9.0-BL
  oval 0.27x1.5 smd: 1(-2.75,-4.25) 2(-2.25,-4.25) 3(-1.75,-4.25) 4(-1.25,-4.25) 5(-0.75,-4.25) 6(-0.25,-4.25) 7(0.25,-4.25) 8(0.75,-4.25) 9(1.25,-4.25) 10(1.75,-4.25) 11(2.25,-4.25) 12(2.75,-4.25) 25(2.75,4.25) 26(2.25,4.25) 27(1.75,4.25) 28(1.25,4.25) 29(0.75,4.25) 30(0.25,4.25) 31(-0.25,4.25) 32(-0.75,4.25) 33(-1.25,4.25) 34(-1.75,4.25) 35(-2.25,4.25) 36(-2.75,4.25)
  oval 1.5x0.27 smd: 13(4.25,-2.75) 14(4.25,-2.25) 15(4.25,-1.75) 16(4.25,-1.25) 17(4.25,-0.75) 18(4.25,-0.25) 19(4.25,0.25) 20(4.25,0.75) 21(4.25,1.25) 22(4.25,1.75) 23(4.25,2.25) 24(4.25,2.75) 37(-4.25,2.75) 38(-4.25,2.25) 39(-4.25,1.75) 40(-4.25,1.25) 41(-4.25,0.75) 42(-4.25,0.25) 43(-4.25,-0.25) 44(-4.25,-0.75) 45(-4.25,-1.25) 46(-4.25,-1.75) 47(-4.25,-2.25) 48(-4.25,-2.75)
Pad_e6953
  round 3.5 hole 3.1: 1(0,0)
Pad_e6955
  round 3.5 hole 3.1: 1(0,0)
R0402
  rect 0.566x0.54 smd: 1(-0.433,0) 2(0.433,0)
R0603
  rect 0.806x0.864 smd: 1(-0.753,0) 2(0.753,0)
SOIC-8_L4.9-W3.9-P1.27-LS6.0-BL
  oval 0.588x2.045 smd: 1(-1.905,-2.772) 2(-0.635,-2.772) 3(0.635,-2.772) 4(1.905,-2.772) 5(1.905,2.772) 6(0.635,2.772) 7(-0.635,2.772) 8(-1.905,2.772)
SOT-23_L2.9-W1.3-P1.90-LS2.4-BR
  rect 1x0.8 smd: 1(1.15,-0.95) 2(1.15,0.95) 3(-1.15,0)
SW-SMD_L6.0-W6.0-LS6.6
  rect 1.985x1.512 smd: 1(-3.192,0) 2(3.192,0)
SW-TH_SS-12D10L5
  oval 2x3 hole 1.3x2: 1(-4.7,0) 2(0,0) 3(4.7,0)
USB-C-SMD_KH-TYPE-C-16P
  oval 1.2x2 hole 0.7x1.7: 1(-4.32,1.765) 2(4.32,1.765)
  rect 0.3x1.3 smd: A1(-3.35,2.415) A4(-2.55,2.415) A5(-1.25,2.415) A6(-0.25,2.415) A7(0.25,2.415) A8(1.25,2.415) A9(2.55,2.415) A12(3.35,2.415) B1(3.05,2.415) B4(2.25,2.415) B5(1.75,2.415) B6(0.75,2.415) B7(-0.75,2.415) B8(-1.75,2.415) B9(-2.25,2.415) B12(-3.05,2.415)
VSON-7_L2.0-W2.0-P0.5-TL
  rect 0.6x0.25 smd: 1(-0.675,0.75)
  oval 0.6x0.25 smd: 2(-0.674,0.248) 3(-0.674,-0.249) 4(-0.674,-0.75)
  rect 1.5x0.3 smd: 5(0.675,-0.601) 6(0.675,-0.001) 7(0.675,0.6)

## Nets
3.3V: 1K#4.1 1K#5.2 1K#6.2 1uF.2 10K.2 10K#2.1 10K#3.1 10K#4.2 10K#5.2 10K#6.2 10K#7.2 10K#8.2 10K#9.2 10K#11.2 10K#13.2 10K#14.2 10K#15.2 100.1 100nF.2 100nF#2.2 100nF#3.2 100nF#4.2 103C8T6.1 103C8T6.9 103C8T6.24 103C8T6.36 103C8T6.48 C24.2 EEPROM.8 H1.1 L1.1 LCD2.10 LCD2.11 LED.2 R151.2 U3.3 U3.6 U17.1 U18.1 U20.3 U20.6 U26.4
4.2V: 100uF.1 C23.1 ON.2 U26.1 U26.7
5V: 10uF#6.1 CHG.2 STD.2 TP4056.4 TP4056.8 USB3.A4 USB3.A9 USB3.B4 USB3.B9
GND: 0#3.1 0#6.1 0#7.2 0#8.1 1.2K-1A.1 1uF.1 3.3V.1 5.1K.1 5.1K#2.2 10uF.1 10uF#2.1 10uF#3.1 10uF#4.1 10uF#5.1 10uF#6.2 10uF#7.1 20uF.1 20uF#2.1 32pF.1 32pF#2.1 100nF.1 100nF#2.1 100nF#3.1 100nF#4.1 100uF.2 103C8T6.8 103C8T6.23 103C8T6.35 103C8T6.47 300K.2 BACK.1 C14.1 C23.2 C24.1 CN1.1 EEPROM.1 EEPROM.2 EEPROM.3 EEPROM.4 EEPROM.7 H1.2 LCD2.1 LCD2.2 LCD2.3 LCD2.5 LCD2.13 LCD2.14 NOREF.1 NOREF#2.1 OK.1 Q1.1 R152.1 RST.1 TP4056.1 TP4056.3 TP4056.9 U3.1 U3.4 U3.9 U3.10 U3.11 U15.2 U17.5 U17.6 U18.5 U18.6 U20.1 U20.4 U20.9 U20.10 U20.11 U21.1 U22.1 U23.1 U24.1 U26.5 USB3.1 USB3.2 USB3.A1 USB3.A12 USB3.B1 USB3.B12 X3.2 X3.4
BAT+: 10uF#7.2 100K.1 ON.1 Q1.2 TP4056.5
BAT_ADC: 100K.2 103C8T6.13 300K.1
BOOT0: 10K#12.1 103C8T6.44
BOOT1: 10K#10.1 103C8T6.20
DN: 103C8T6.32 USB3.A7 USB3.B7
DP: 103C8T6.33 USB3.A6 USB3.B6
IIC_SCL: 10K#14.1 103C8T6.42 EEPROM.6
IIC_SDA: 10K#15.1 103C8T6.43 EEPROM.5
KEY_BACK: 10K#4.1 10uF.2 103C8T6.26 BACK.2
KEY_DOWN: 10K#8.1 10uF#4.2 103C8T6.27 U24.2
KEY_LEFT: 10K#5.1 10uF#2.2 103C8T6.29 U21.2
KEY_OK: 10K#9.1 10uF#5.2 103C8T6.25 OK.2
KEY_RIGHT: 10K#6.1 103C8T6.28 C14.2 U22.2
KEY_UP: 10K#7.1 10uF#3.2 103C8T6.38 U23.2
LED: 1K.2 103C8T6.2
PH0: 1M.1 32pF#2.2 103C8T6.5 X3.3
PH1: 1M.2 32pF.2 103C8T6.6 X3.1
R_RX: 0#2.1 0#5.1 103C8T6.22
R_TX: 0.1 0#4.1 103C8T6.21
REST: 10K.1 20uF#2.2 103C8T6.7 RST.2
RX: 103C8T6.31 H1.5
SWCLK: 103C8T6.37 H1.3
SWDIO: 103C8T6.34 H1.4
TFT_CLK: 103C8T6.15 LCD2.9
TFT_CS: 103C8T6.14 LCD2.12
TFT_DC: 103C8T6.46 LCD2.7
TFT_MOSI: 103C8T6.17 LCD2.8
TFT_RST: 103C8T6.16 LCD2.6
TX: 103C8T6.30 H1.6
YG1_KEY: 103C8T6.39 U3.7 U3.8
YG1_RL: 103C8T6.18 U3.5
YG1_UD: 103C8T6.19 U3.2
YG2_KEY: 103C8T6.12 U20.7 U20.8
YG2_RL: 103C8T6.10 U20.5
YG2_UD: 103C8T6.11 U20.2
$1N1912: 5.1K#2.1 USB3.B5
$1N1923: 5.1K.2 USB3.A5
$1N3298: 1K#2.1 TP4056.7
$1N3324: 1K#3.1 TP4056.6
$1N3379: 1K#2.2 CHG.1
$1N3431: 1K#3.2 STD.1
$1N3545: 1.2K-1A.2 TP4056.2
$1N3747: 1K#4.2 3.3V.2
$1N4239: 0#7.1 10K#10.2 10K#11.1
$1N4323: 0#8.2 10K#12.2 10K#13.1
$1N4920: TX.1 U17.7
$1N4922: RX.1 U18.7
$1N4948: 1K#5.1 TX.2
$1N4998: 1K#6.1 RX.2
$1N5115: 0.2 U17.2
$1N5141: 0#2.2 U17.3
$1N5167: 0#3.2 10K#2.2 U17.4
$1N5370: 0#6.2 10K#3.2 U18.4
$1N5386: 0#4.2 U18.2
$1N5388: 0#5.2 U18.3
$1N5750: 100.2 LCD2.4
$1N7594: 1K.1 LED.1
$1N9396: 20uF.2 CN1.2 Q1.3 U15.1
$1N13811: L1.2 U26.6
$1N13827: R151.1 R152.2 U26.3

Pads without a net: 103C8T6 3 4 40 41 45; CN1 3 4; ON 3; U26 2; USB3 A8 B8

## Via types
v1: diameter 0.61, hole 0.305, Top Layer to Bottom Layer, 170 vias

## Routing (per net, layer and track width the routed paths; a pad name or vN(x,y) marks a point on that pad's centre or on a via; arc(x,y) is an arc through that point)
3.3V: length 529.6
  Top Layer w0.254: 33.7,48.57 33.42,48.85 LCD2.11 LCD2.10 33.42,48.05 v1(33.63,47.83) ; 1K#4.1 4.5,20.38 v1(6.9,20.38)
  Top Layer w0.5: U20.6 84.36,45.25 10K#7.2 84.36,23.8 81.91,21.34 80.79,21.34 79.93,20.47 79.93,20.04 80.49,19.48 81.21,19.48 84.53,16.16 84.53,9.12 10K#8.2 ; U20.6 85.82,48.06 85.82,61.73 85.64,61.91 82.73,61.91 10K#3.1 ; U20.6 77.49,52.12 U20.3 ; 10K#5.2 78.27,20.37 76.75,18.85 70.4,18.85 69.51,19.74 69.51,21.01 70.55,22.06 73.48,22.06 73.83,22.41 73.83,24.19 69.64,28.38 LED.2 ; U17.1 10.55,69.01 U3.6 12.51,58.57 U3.3 19.98,56.11 v1(19.98,54.6) v1(19.98,53.88) 19.98,53.14 25.08,48.05 LCD2.10 ; v1(61.68,39.47) 72.49,50.28 U20.3 ; 1K#5.2 27.02,68.38 17.45,68.38 10K#2.1 ; v1(48.18,54.41) 51.73,57.97 51.73,59.97 H1.1 ; U20.3 58.72,52.12
  Top Layer w0.8: U18.1 69.55,73.55 67.28,71.28 59.83,71.28 ; 59.71,71.28 59.45,71.54 ; H1.1 51.6,60.1 58.93,60.1 62.77,63.94 10K.2 62.88,64.94 62.88,70.89 ; 59.45,71.66 1K#6.2
  Top Layer w1: v1(32.49,37.91) v1(31.54,37.91) 20.49,37.91 15.53,32.94 10K#9.2 10K#4.2 15.53,20.24 14.39,19.11 10.08,19.11 v1(9.82,19.36) ; 10K#6.2 10K#5.2
  Bottom Layer w0.254: 10K#13.2 47.67,33.79 48.3,33.16 49.39,33.16 51.73,35.5 51.73,43.65 ; 34.06,52.49 34.19,52.62 37.01,52.62 38.4,51.24 40.74,51.24 40.75,51.23 103C8T6.24 40.79,51.14 41.79,51.14 42.97,49.96 42.97,48.88 43.75,48.1 ; v1(58.75,52.13) 57.61,53.27 56.05,53.27 55.31,52.53 EEPROM.8 ; 43.75,48.1 44.53,48.1 47.75,51.32 103C8T6.36 47.75,53.99 v1(48.18,54.41) ; 43.75,48.1 43.75,47.97 ; 43.75,47.97 103C8T6.9 ; 43.75,47.97 45.18,46.54 46.33,46.54 47.11,45.77 47.11,45.64 47.62,45.12 47.62,44.93 47.66,44.89 47.66,44.19 103C8T6.1 ; 51.73,43.65 51.73,44.64 50.77,45.6 103C8T6.48 ; 51.73,43.65 51.76,43.62 57.82,43.62 10K#15.2 10K#14.2 ; C24.2 11.49,19.87 L1.1 11.49,15.02 R151.2 14.77,11.73 14.77,9.58 14.15,8.96 U26.4 ; 33.63,47.41 v1(33.63,47.83)
  Bottom Layer w0.5: v1(33.63,47.83) 33.63,52.07 34.06,52.49 ; 26.34,43.11 19.98,49.47 v1(19.98,53.08) v1(19.98,53.88) ; v1(61.68,39.47) 60.15,39.47 52.11,31.43 39.5,31.43 37.72,33.21 ; 33.63,47.41 33.63,37.99 ; U20.3 72.61,52.25 72.74,52.25 79.67,59.18 79.67,61.4 77.46,63.61 77.46,63.61 76.77,64.29 76.77,64.3 69.64,71.43 v1(69.64,74.23) ; U3.6 10.94,69.4 v1(16.55,69.4)
  Bottom Layer w0.8: 10K#11.2 39.81,33.79 39.26,33.24 38.56,33.24 38.52,33.21 37.72,33.21 33.02,37.91
  Bottom Layer w1: v1(32.49,37.91) v1(33.7,37.91) ; v1(31.54,37.91) 26.34,43.11 18.58,43.11 7.81,32.33 7.81,23.17 9.58,21.39
4.2V: length 11.4
  Top Layer w1.2: ON.2 8.81,6.79 100uF.1
  Bottom Layer w0.254: U26.7 10.06,10.46 U26.1
5V: length 53.5
  Top Layer w0.6: 42.59,65.77 42.59,63.92 42.18,63.51 v1(42.14,63.56) v1(41.26,63.56) v1(40.43,63.56) 39.28,64.71 36.14,64.71 CHG.2 ; v1(47.42,64.31) 47.42,65.81
  Top Layer w1: STD.2 CHG.2
  Bottom Layer w0.254: TP4056.4 24.39,58.66 10uF#6.1
  Bottom Layer w0.4: v1(47.42,64.31) 47.42,64.18 46.29,63.05 45.89,63.05 45.78,62.95 45.78,62.91 45.4,62.52 44.85,62.52 43.86,63.51 25.62,63.51 25.01,62.9 25.01,62.65 24.51,62.16 TP4056.4
  Bottom Layer w1: v1(35.6,68.51) 35.73,68.38 v1(35.73,66.99) 29.63,66.99 28.65,67.97 TP4056.8
GND: length 8.1
  Top Layer w0.254: 78.45,46.16 U20.4
  Bottom Layer w0.254: 10uF#6.2 27.2,59.63 1.2K-1A.1 28.2,61.12 v1(28.2,62.16) ; v1(48.05,46.29) 48.24,46.1 103C8T6.47 ; v1(46.78,51.24) 47.25,51.71 103C8T6.35
  vias: v1(6.81,25.35) v1(7,36.35) v1(17.35,6.79) v1(25.66,62.16) v1(35.09,43.75) v1(35.09,42.79) v1(35.09,41.71) v1(35.09,39.17) v1(35.09,37.54) v1(35.22,50.1) v1(35.86,38.41) v1(36.24,43.81) v1(36.24,42.86) v1(36.24,39.43) v1(36.36,37.14) v1(37,39.68) v1(37,38.66) v1(37.13,36.25) v1(37.41,43.81) v1(37.63,37.52) v1(37.89,40.83) v1(37.89,35.36) v1(38.14,39.68) v1(38.14,38.62) v1(38.27,36.63) v1(38.4,41.46) v1(38.9,42.1) v1(39.16,41.08) v1(39.16,40.07) v1(39.16,39.17) v1(39.16,38) v1(39.16,37.13) v1(39.16,35.93) v1(39.41,50.6) v1(41.06,42.59) v1(41.19,37.53) v1(41.44,43.62) v1(41.95,42.6) v1(43.09,47.05) v1(43.9,38.35) v1(44.24,42.88) v1(44.49,33.36) v1(45.89,47.3) v1(46.1,40.18) v1(47.55,35.83) v1(47.79,49.21) v1(48.03,36.4) v1(48.3,57.08) v1(48.3,56.21) v1(48.56,52.51) v1(48.81,40.03) v1(50.08,34.86) v1(50.46,44.64) v1(50.77,42.83) v1(50.79,35.39) v1(51.1,39.56) v1(52.75,45.4) v1(52.75,44.44) v1(55.16,45.52) v1(55.31,48.88) v1(55.92,44.76) v1(57.19,47.18) v1(57.19,46.41) v1(58.08,47.22) v1(58.08,46.48) v1(67.48,30.92) v1(69.58,25.06) v1(70.78,28.89) v1(71.54,28.13) v1(71.67,17.97) v1(71.94,20.38) v1(72.65,17.97) v1(73.6,17.97) v1(74.5,17.97) v1(75.48,17.97) v1(75.79,36.35) v1(75.79,13.67) v1(76.44,17.97) v1(78.04,31.94) v1(78.16,9.08) v1(78.27,19.24) v1(79.73,19.24) v1(81.07,18.6) v1(81.7,17.97) v1(82.01,25.06) v1(82.34,17.33) v1(83.05,16.64) v1(84.39,20.38)
(no net):
  vias: v1(90.26,-0.31)
BAT+: length 104.1
  Top Layer w0.254: ON.1 3.98,16.7 100K.1
  Top Layer w1.5: ON.1 6.14,14.16 10.64,14.16 Q1.2
  Bottom Layer w1.5: ON.1 4.23,16.57 4.23,41.71 7.79,45.27 7.79,59.37 1.19,65.97 1.19,72.45 5.88,77.15 20.11,77.15 21.76,75.5 21.76,68.11 10uF#7.2
BAT_ADC: length 61.3
  Top Layer w0.254: v1(38.9,34.09) 21.5,34.09 17.57,30.16 17.57,20.63 15.09,18.16 5.96,18.16 5.07,19.05 5.07,19.3 300K.1 100K.2
  Bottom Layer w0.254: v1(38.9,34.09) 39.92,35.11 39.92,43.74 40.75,44.57 103C8T6.13
BOOT0: length 16.5
  Bottom Layer w0.254: 103C8T6.44 48.09,47.6 47.62,47.12 47.62,46.81 47.29,46.48 47.29,46.29 47.46,46.11 47.46,46.04 47.81,45.7 47.87,45.7 49.57,44 49.57,36 48.85,35.27 48.85,33.84
BOOT1: length 18.3
  Bottom Layer w0.254: 103C8T6.20 41.81,49.1 42.33,48.57 42.33,45.65 40.3,43.62 40.3,35.9 10K#10.1
DN: length 17.5
  Top Layer w0.254: USB3.A7 44.82,66.01 44.82,66.7 44.98,66.86 45.52,66.86 45.68,66.7 45.68,66.01 USB3.B7 45.75,64.08 v1(45.76,64.07)
  Inner1 w0.254: v1(45.76,64.07) 45.89,64.07 46.78,63.18 46.78,61.64 47.58,60.84 47.58,59.86 46.78,59.06 46.78,57.21 v1(46.65,57.08)
  Bottom Layer w0.254: 103C8T6.32 45.84,52.69 45.84,56.08 46.65,56.89 v1(46.65,57.08)
DP: length 16.7
  Top Layer w0.254: USB3.B6 44.32,65.86 44.32,65.17 44.48,65.01 45.02,65.01 45.18,65.17 45.18,65.86 USB3.A6 45.25,64.44 45,64.19 45,63.3 v1(45.13,63.18)
  Inner1 w0.254: v1(46.42,55.68) 46.42,56.49 45.09,57.82 45.09,63.14 v1(45.13,63.18)
  Bottom Layer w0.254: v1(46.42,55.68) 46.42,53.47 46.34,53.39 46.34,52.69 103C8T6.33
IIC_SCL: length 12.5
  Bottom Layer w0.254: 10K#14.1 57.2,48.2 56.68,47.68 EEPROM.6 53.89,47.68 53,48.57 49.28,48.57 103C8T6.42
IIC_SDA: length 9.5
  Bottom Layer w0.254: 10K#15.1 55.31,46.4 EEPROM.5 54.66,46.41 52.88,48.19 50.04,48.19 50.04,48.19 49.34,48.19 103C8T6.43
KEY_BACK: length 58.3
  Top Layer w0.254: v1(26.2,49.21) 26.2,50.29 30.65,54.73 v1(30.65,54.92) ; 10uF.2 10K#4.1 14.02,24.52 v1(13.19,25.35)
  Inner1 w0.254: 13.25,25.33 14.01,26.09 14.01,36.76 26.2,48.96 v1(26.2,49.21)
  Bottom Layer w0.254: v1(30.65,54.92) 31.16,54.92 31.44,54.64 41.59,54.64 42.75,53.49 103C8T6.26
KEY_DOWN: length 66.3
  Top Layer w0.254: v1(46.52,45.52) v1(52.37,39.68) ; 82.18,13.67 v1(80.56,15.3) ; 10uF#4.2 10K#8.1 82.98,12.86 U24.2
  Inner1 w0.254: v1(52.37,39.68) 52.75,39.3 54.17,39.3 74.92,18.55 77.31,18.55 v1(80.56,15.3) ; v1(43.6,49.97) 44.42,49.16 44.42,45.66 44.76,45.32 45.24,45.32 45.44,45.52 v1(46.52,45.52)
  Bottom Layer w0.254: 103C8T6.27 43.25,50.32 v1(43.6,49.97)
KEY_LEFT: length 52
  Top Layer w0.254: v1(47.41,48.19) 47.38,48.19 v1(45.55,50.02) ; v1(67.22,32.57) 68.7,31.1 70.47,31.1 70.65,30.92 70.65,30.37 U21.2 76.76,24.27 10K#5.1 10uF#2.2
  Inner1 w0.254: v1(67.22,32.57) 51.6,48.19 v1(47.41,48.19)
  Bottom Layer w0.254: 103C8T6.29 44.34,52.51 44.34,51.81 45.55,50.6 v1(45.55,50.02)
KEY_OK: length 46.8
  Top Layer w0.254: 10uF#5.2 11.08,31.17 10K#9.1 14.01,31.18 14.01,35.53 OK.2 ; v1(30.65,53.91) 30.65,53.89 v1(26.79,50.03)
  Inner1 w0.254: v1(13.38,36.25) 13.38,36.63 25.62,48.88 25.62,49.45 25.96,49.79 26.55,49.79 v1(26.79,50.03)
  Bottom Layer w0.254: 103C8T6.25 42.25,53.48 41.44,54.29 31.03,54.29 v1(30.65,53.91)
KEY_RIGHT: length 65.7
  Top Layer w0.254: v1(47.03,47.05) 47.03,47.37 v1(45,49.4) ; v1(72.81,23.61) 72.81,24.32 66.08,31.05 v1(66.08,32.44) ; v1(81.31,20.38) 82.08,20.38 83.48,18.98 84.99,18.98 C14.2 88.39,22.39 U22.2
  Inner1 w0.254: v1(66.08,32.44) 66.08,33.21 52.17,47.12 47.11,47.12 v1(47.03,47.05) ; v1(81.31,20.38) 76.04,20.38 v1(72.81,23.61)
  Bottom Layer w0.254: v1(45,49.4) 43.75,50.65 103C8T6.28
KEY_UP: length 46.4
  Top Layer w0.254: 10uF#3.2 10K#7.1 82.85,35.67 U23.2 77.83,40.7 v1(69.89,40.7)
  Inner1 w0.254: v1(53.89,49.46) 61.13,49.46 v1(69.89,40.7)
  Bottom Layer w0.254: 103C8T6.38 50.52,50.6 50.6,50.68 51.08,50.68 51.16,50.6 52.75,50.6 v1(53.89,49.46)
LED: length 26.8
  Top Layer w0.254: v1(47.29,42.86) 50.21,39.94 50.21,39.69 50.51,39.39 50.51,38.55 50.85,38.21 51.93,38.21 53.39,36.75 1K.2
  Bottom Layer w0.254: v1(47.29,42.86) 47.29,44.06 103C8T6.2
PH0: length 11.7
  Bottom Layer w0.254: X3.3 46.1,38.48 47.08,39.46 47.08,40.91 45.76,42.22 45.76,44.09 103C8T6.5 ; X3.3 45.75,38.13 1M.1 ; X3.3 46.25,38.63 32pF#2.2
PH1: length 12.1
  Bottom Layer w0.254: X3.1 45.25,41.53 103C8T6.6 ; 32pF.2 41.34,40.18 43.65,40.18 42.67,39.19 42.67,37.6 43.99,36.28 1M.2
R_RX: length 76.2
  Top Layer w0.254: 0#2.1 14.65,68.77 v1(17.31,66.1) ; 73.57,69.86 65.88,62.16 v1(64.81,62.16)
  Inner1 w0.254: v1(36.87,51.62) 36.81,51.62 36.22,52.2 31.21,52.2 v1(17.31,66.1) ; v1(41.92,50.19) 45.51,53.78 56.43,53.78 v1(64.81,62.16)
  Bottom Layer w0.254: v1(41.92,50.19) 41.83,50.1 103C8T6.22 40.66,50.01 39.96,50.01 39.92,49.97 38.39,49.97 36.87,51.49 v1(36.87,51.62)
R_TX: length 77.7
  Top Layer w0.254: 71.54,69.86 71.54,68.91 v1(66.2,63.56) ; 0.1 12.61,69.4 v1(17.06,64.96)
  Inner1 w0.254: v1(42.38,49.58) 42.45,49.58 42.84,49.97 42.84,50.38 45.89,53.42 56.96,53.42 66.2,62.66 v1(66.2,63.56) ; v1(17.06,64.96) 30.4,51.62 v1(35.98,51.62)
  Bottom Layer w0.254: v1(35.98,51.62) 35.98,51.49 38,49.47 39.92,49.47 39.96,49.51 40.66,49.51 103C8T6.21 40.84,49.51 41.54,49.51 41.6,49.58 v1(42.38,49.58)
REST: length 36.5
  Top Layer w0.254: 57.94,64.96 61.14,64.96 61.26,64.83 ; 57.94,64.96 20uF#2.2 ; 57.94,64.96 57.95,64.94 v1(57.95,62.67) ; RST.2 59.79,68.31 61.08,68.31 61.26,68.13 61.26,64.83 ; 61.26,64.83 10K.1
  Inner1 w0.254: v1(45,45.91) 45,47.3 v1(50.33,52.64)
  Bottom Layer w0.254: v1(57.95,62.67) 57.95,60.26 v1(50.33,52.64) ; v1(45,45.91) 44.75,45.66 103C8T6.7
RX: length 9.4
  Bottom Layer w0.254: 103C8T6.31 45.25,56.29 H1.5
SWCLK: length 10.5
  Bottom Layer w0.254: H1.3 49.25,57.37 103C8T6.37
SWDIO: length 9.7
  Bottom Layer w0.254: H1.4 44.24,60.35 47.26,57.33 47.26,53.81 46.84,53.39 46.84,52.69 103C8T6.34
TFT_CLK: length 9.2
  Top Layer w0.254: LCD2.9 37.56,47.25 v1(38.27,46.54)
  Bottom Layer w0.254: v1(38.27,46.54) 40.69,46.54 103C8T6.15
TFT_CS: length 10.9
  Top Layer w0.254: LCD2.12 33.89,49.65 35.93,47.61 38.03,47.61 38.9,46.73 v1(38.9,45.96)
  Bottom Layer w0.254: v1(38.9,45.96) 38.96,46.01 40.66,46.01 103C8T6.14
TFT_DC: length 22.4
  Top Layer w0.254: LCD2.7 v1(35.86,45.65)
  Inner1 w0.254: v1(51.22,46.54) 49.57,44.89 v1(39.28,44.89)
  Bottom Layer w0.254: v1(39.28,44.89) 37.76,44.89 37,45.65 v1(35.86,45.65) ; v1(51.22,46.54) 51.16,46.6 103C8T6.46
TFT_MOSI: length 9.4
  Top Layer w0.254: LCD2.8 36.66,46.45 v1(36.87,46.67)
  Bottom Layer w0.254: 103C8T6.17 37.81,47.6 v1(36.87,46.67)
TFT_RST: length 10.2
  Top Layer w0.254: v1(37.54,46.13) 36.26,44.85 LCD2.6
  Bottom Layer w0.254: 103C8T6.16 38.54,47.1 38.51,47.12 38.03,47.12 37.54,46.64 v1(37.54,46.13)
TX: length 11
  Bottom Layer w0.254: 103C8T6.30 44.75,52.75 44.76,52.76 44.76,55.36 41.13,59 40.51,59 39.08,60.42 38.72,60.42 H1.6
YG1_KEY: length 56.4
  Top Layer w0.254: U3.7 11.94,50.42 ; 11.94,50.42 11.87,50.36 11.87,50.23 21.85,40.25 35.48,40.25 39.87,44.65 39.87,45.41 45.06,50.6 45.79,50.6 45.98,50.41 50.14,50.41 50.52,50.03 50.65,50.03 50.72,50.1 v1(50.84,50.1) ; 11.94,50.42 U3.8
  Bottom Layer w0.254: 103C8T6.39 49.25,50.1 v1(50.84,50.1)
YG1_RL: length 38.9
  Inner1 w0.254: v1(29.89,50.99) 35.35,50.99 v1(37.13,49.21)
  Bottom Layer w0.254: U3.5 16.25,57.34 23.54,57.34 v1(29.89,50.99) ; 103C8T6.18 39.13,48.1 39.02,47.99 38.34,47.99 v1(37.13,49.21)
YG1_UD: length 26.4
  Inner1 w0.254: v1(29.89,49.31) 36.01,49.31 36.75,48.57 v1(38.78,48.57)
  Bottom Layer w0.254: 103C8T6.19 40.72,48.57 v1(38.78,48.57) ; U3.2 23.12,56.07 v1(29.89,49.31)
YG2_KEY: length 50.9
  Top Layer w0.254: U20.8 U20.7 ; v1(51.41,51.81) 51.48,51.75 51.48,49.91 51.08,49.51 50.45,49.51 47.35,46.41 46.59,46.41 45.5,45.32 44.76,45.32 44.3,45.78 43.22,45.78 v1(42.97,45.52)
  Bottom Layer w0.254: v1(51.41,51.81) 57.83,58.22 75.89,58.22 U20.8 ; 103C8T6.12 42.34,44.19 42.34,44.89 42.97,45.52 v1(42.97,45.52)
YG2_RL: length 43.8
  Inner1 w0.254: v1(43.73,42.1) 43.73,42.48 43.53,42.68 43.53,43.23 43.89,43.59 51.63,43.59 52.54,42.68 52.54,42.49 52.89,42.15 53.86,42.15 54.02,41.99 v1(54.02,41.84)
  Bottom Layer w0.254: 103C8T6.10 43.25,42.58 v1(43.73,42.1) ; v1(54.02,41.84) 77.1,41.84 U20.5
YG2_UD: length 39.3
  Inner1 w0.254: v1(53.25,42.73) 53.13,42.73 51.91,43.95 43.74,43.95 43.02,43.23 43.02,41.66 42.97,41.71 v1(42.97,41.84)
  Bottom Layer w0.254: 103C8T6.11 42.75,42.06 v1(42.97,41.84) ; v1(53.25,42.73) 60.59,42.73 U20.2
$1N1912: length 6.5
  Top Layer w0.254: 5.1K#2.1 42.32,68.14 43.22,67.24 43.22,65.96 USB3.B5
$1N1923: length 7
  Top Layer w0.254: 5.1K.2 47.17,68.14 46.25,67.22 USB3.A5
$1N3298: length 3.9
  Bottom Layer w0.254: TP4056.7 27.62,67.28 27.62,67.26 27.78,67.1 27.81,67.1 29.63,65.27 29.63,65.21
  vias: v1(29.68,65.2)
$1N3324: length 5.3
  Bottom Layer w0.254: v1(29.6,68.38) 28.84,69.15 25.95,69.15 25.66,68.85 TP4056.6
$1N3379: length 2.3
  Top Layer w0.254: CHG.1 33.43,65.21 1K#2.2
$1N3431: length 2.3
  Top Layer w0.254: 1K#3.2 31.15,68.39 STD.1
$1N3545: length 2.9
  Bottom Layer w0.254: TP4056.2 26.93,61.35 1.2K-1A.2
$1N3747: length 2.6
  Top Layer w0.254: 1K#4.2 1.83,24.57 1.83,27.2
$1N4239: length 4.5
  Bottom Layer w0.254: 40.12,32.28 44.25,32.28 0#7.1
$1N4323: length 4.5
  Bottom Layer w0.254: 0#8.2 50.6,32.28 46.6,32.28
$1N4920: length 4.9
  Top Layer w0.254: U17.7 25.93,76.09 TX.1
$1N4922: length 16.4
  Top Layer w0.254: 63.85,76.18 80.12,76.18 U18.7
$1N4948: length 2.5
  Top Layer w0.254: 1K#5.1 29.35,72.86 27.59,74.63
$1N4998: length 2.5
  Top Layer w0.254: 1K#6.1 60.53,72.85 RX.2
$1N5115: length 3.2
  Top Layer w0.254: 0.2 12.58,70.89 U17.2
$1N5141: length 3.2
  Top Layer w0.254: U17.3 14.65,74.02 0#2.2
$1N5167: length 5.7
  Top Layer w0.254: U17.4 16.42,74.02 10K#2.2 18.9,70.92 0#3.2
$1N5370: length 6.1
  Top Layer w0.254: U18.4 75.39,70.75 10K#3.2 78.09,70.66 0#6.2
$1N5386: length 3.3
  Top Layer w0.254: 0#4.2 71.58,70.76 U18.2
$1N5388: length 3.3
  Top Layer w0.254: 0#5.2 73.61,70.76 U18.3
$1N5750: length 5.6
  Top Layer w0.5: v1(29.75,43.24) 31.84,43.24 LCD2.4
  Bottom Layer w0.5: 100.2 29.76,43.12 29.76,43.37
$1N7594: length 2.8
  Top Layer w0.254: 1K.1 69.64,32.46 LED.1
$1N9396: length 70.6
  Bottom Layer w1.5: CN1.2 76.37,25.33 71.8,25.33 68.33,28.79 26.49,28.79 18.84,21.14 U15.1
$1N13811: length 18.2
  Bottom Layer w0.254: U26.6 1.82,9.71 1.64,9.89 1.64,12.83 2.84,14.03 5.87,14.03 L1.2
$1N13827: length 4.2
  Bottom Layer w0.254: 13.25,9.83 12.88,9.46 U26.3 ; 13.25,9.83 R152.2 ; 13.25,9.83 R151.1

## Copper pours and planes (outline as drawn; the poured copper is in the pictures)
3.3V on Bottom Layer: 12.49,14.14 12.49,22.28 6.14,22.28 6.14,18.15 10.25,18.17 10.25,14.16 10.64,14.16 10.65,14.14
4.2V on Bottom Layer: 6.45,12.98 8.57,11.52 10.77,10.5 10.77,10.08 2.2,10.08 2.2,12.98
GND on Top Layer: -15.33,82.23 101.9,82.23 101.9,-6.67 -15.33,-6.67
GND on Bottom Layer: 9.06,9.23 10.66,9.23 10.66,8.44 9.06,8.44
GND on Bottom Layer: -6.56,81.21 96.31,81.21 96.31,-4.26 -6.56,-4.26
GND on Inner2: 0.26,78.09 89.7,78.09 89.7,0.26 0.26,0.26
BAT+ on Bottom Layer: 24.81,68.89 24.81,67.19 21.12,67.19 21.12,68.89
$1N9396 on Top Layer: 13.31,17 19.91,17 19.91,15.01 13.31,15.01

Small or netless copper shapes (teardrops, artwork), in the pictures only: 172 on Top Layer, 136 on Bottom Layer, 32 on Inner1, 100 on Inner2

## Text on the board
Bottom Silkscreen Layer: + | TX | RX | DIO | CLK | GND | 3.3 | 1S电池
Top Layer: ABO
Top Solder Mask Layer: ABO
Top Silkscreen Layer: LEFT | UP | DOWN | RIGHT | OFF
